# EasyEDA Pro project STM32平衡小车V1.2.eprj

# Schematic 平衡小车

## Sheets
1 STM32F103C8T6: Create Date: 2023-11-09; Page Name: STM32F103C8T6; Project Name: STM32平衡小车V1.2; Schematic Name: 平衡小车; Update Date: 2023-12-28; Company: 嘉立创EDA; Page Size: A4; Version: V1.0
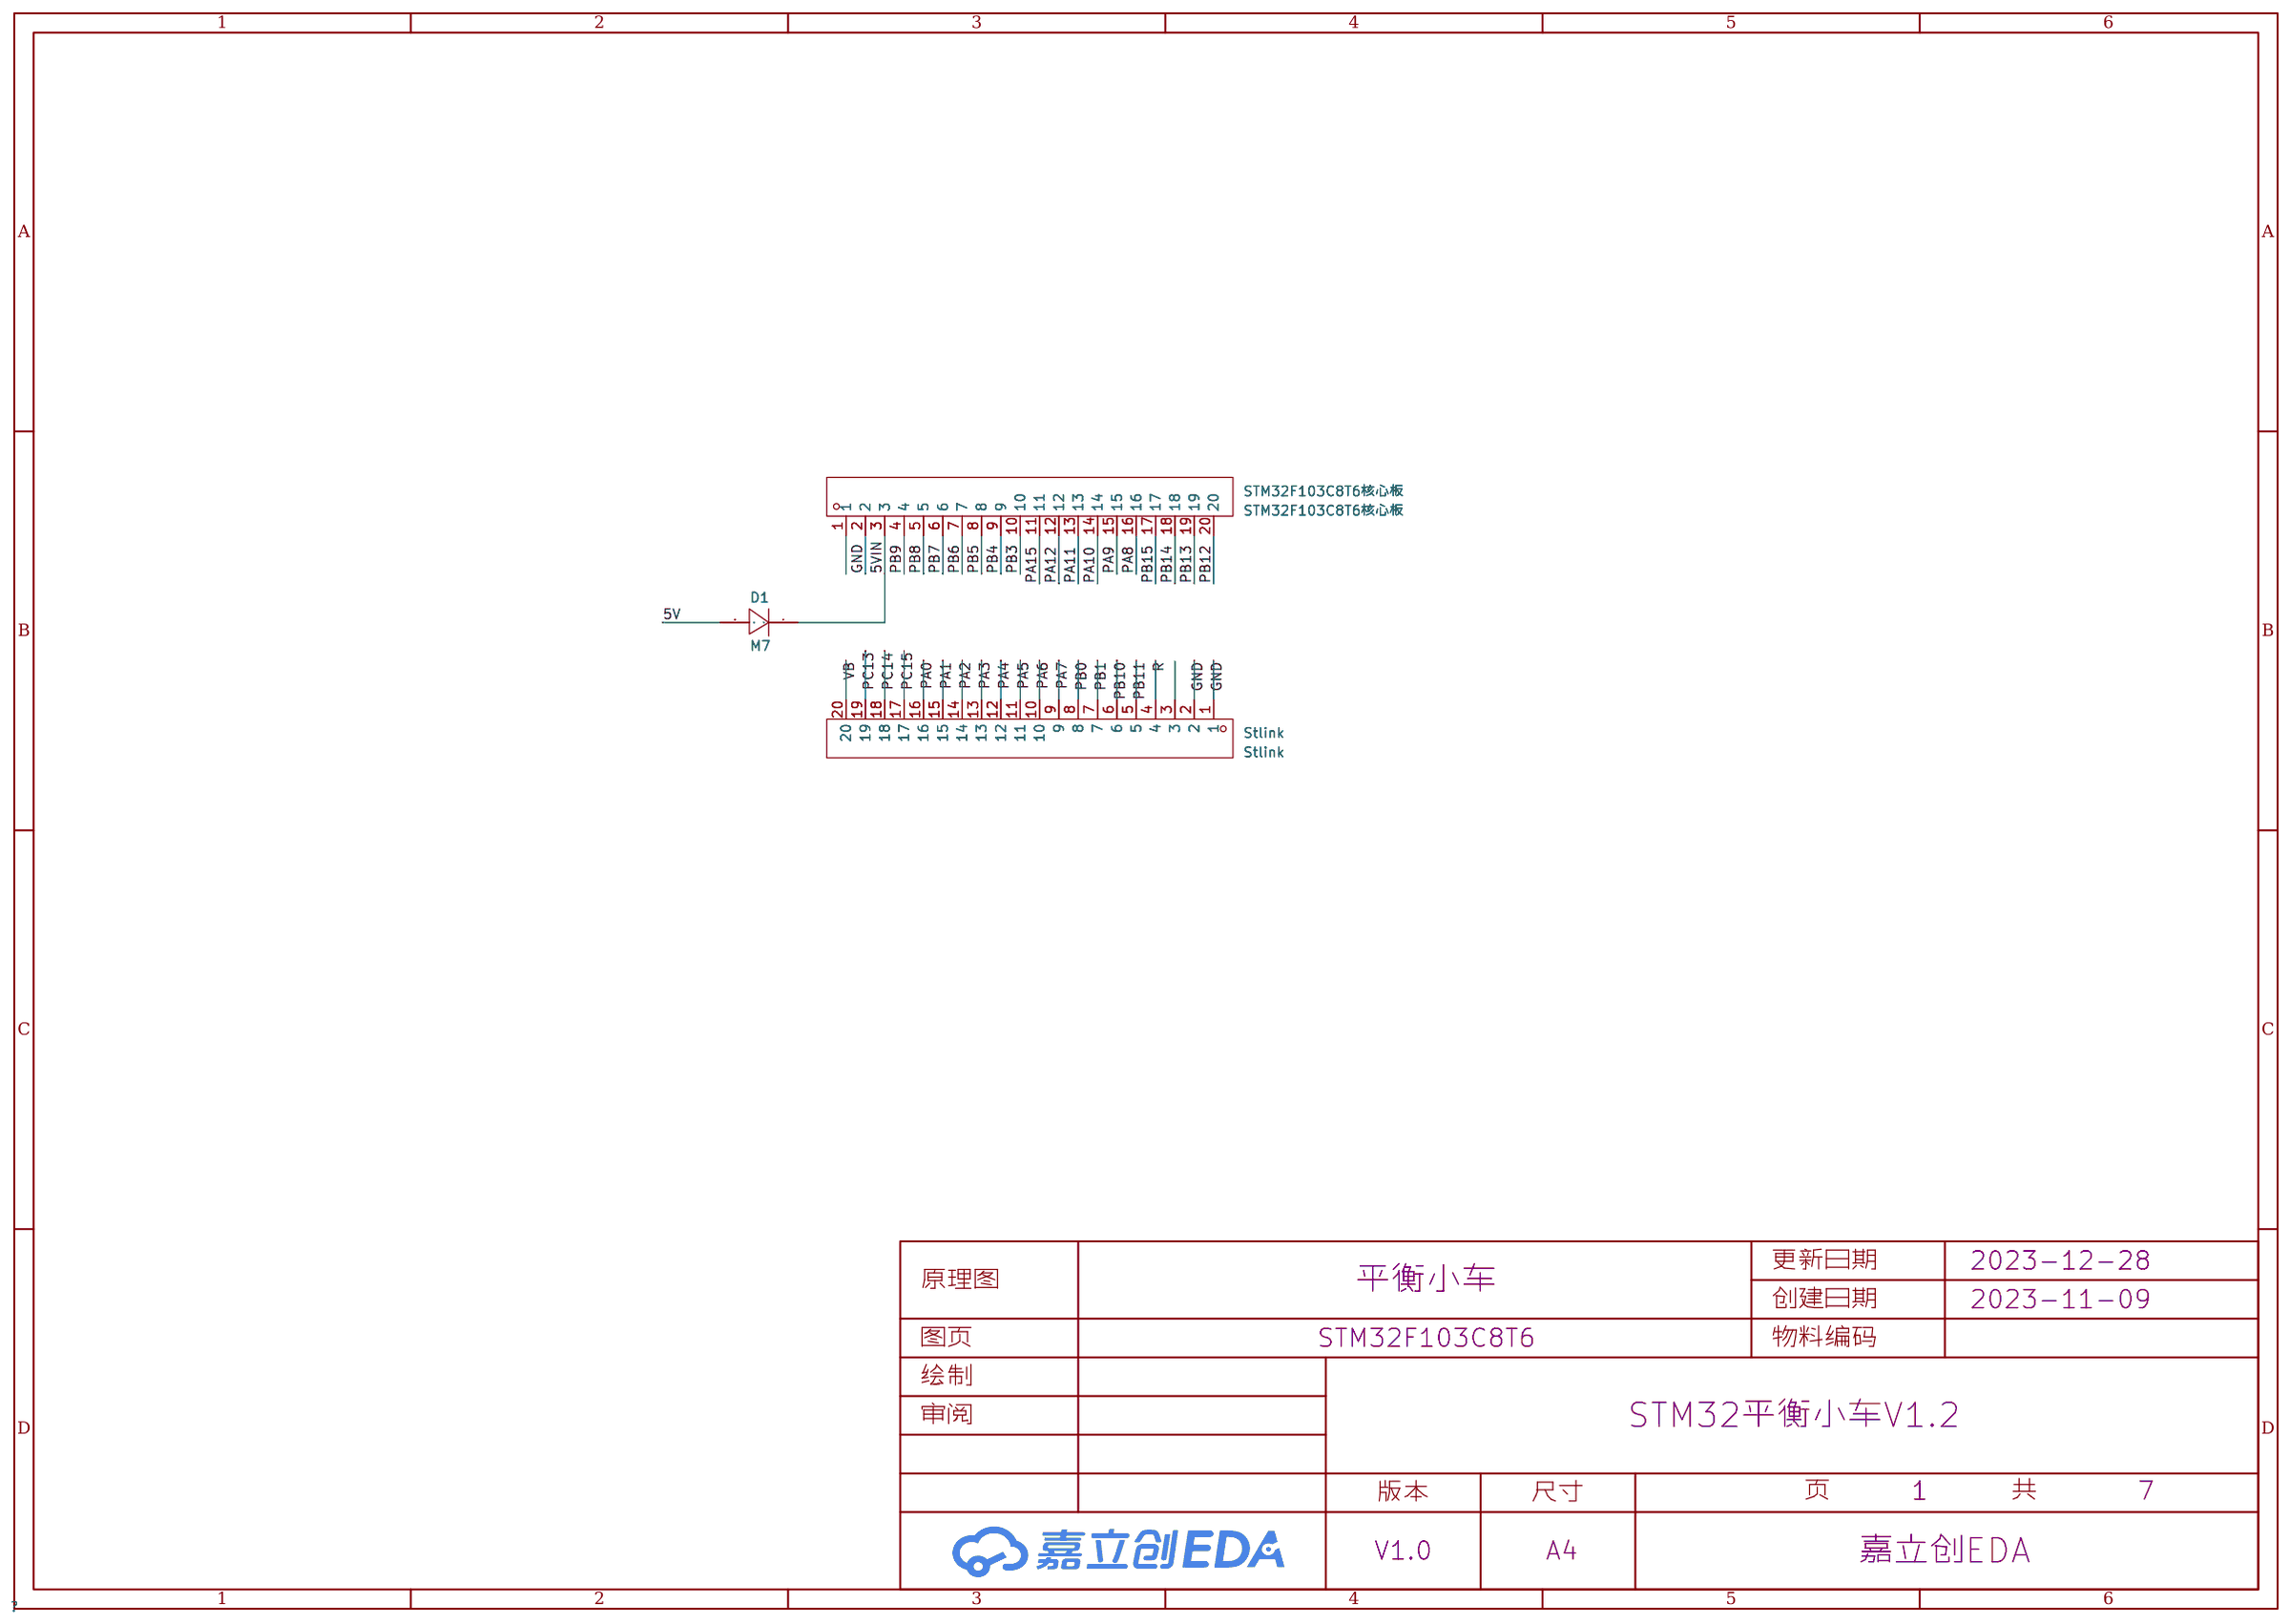
[diagram p0: STM32F103C8T6]
2 蓝牙: Page Name: 蓝牙; Update Date: 2023-12-26
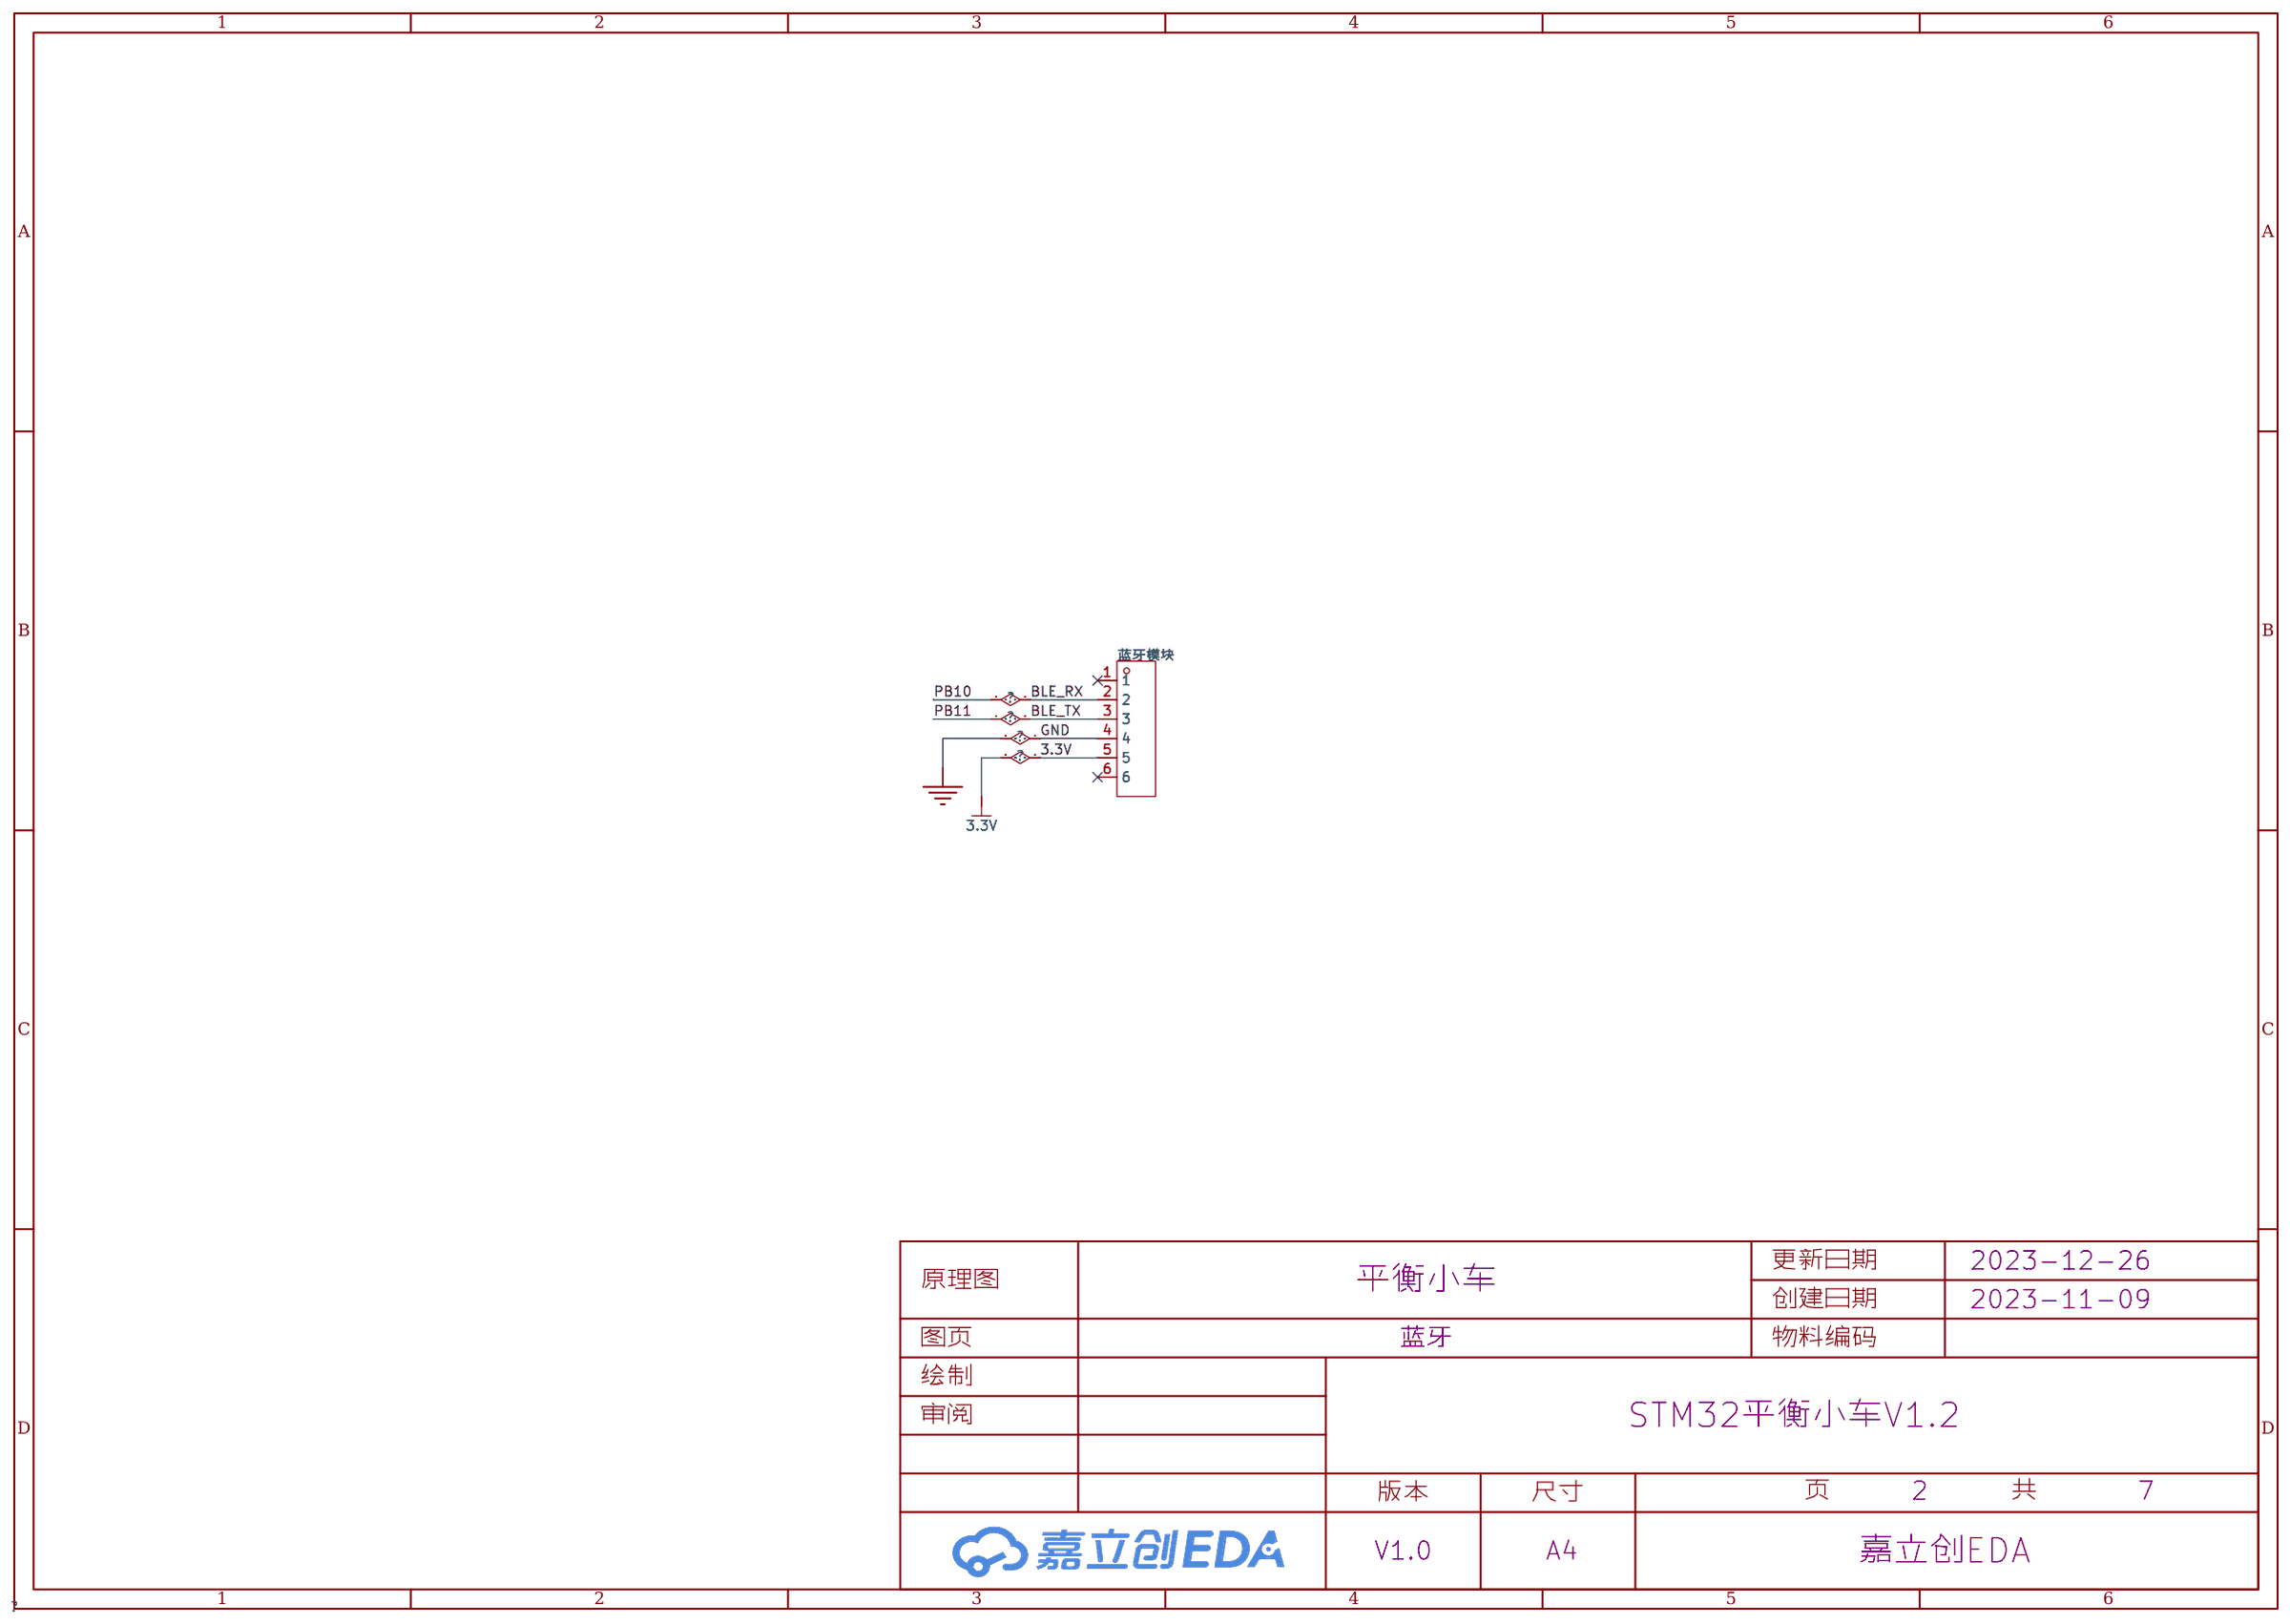
[diagram p1: 蓝牙]
3 陀螺仪: Page Name: 陀螺仪; Update Date: 2024-01-15
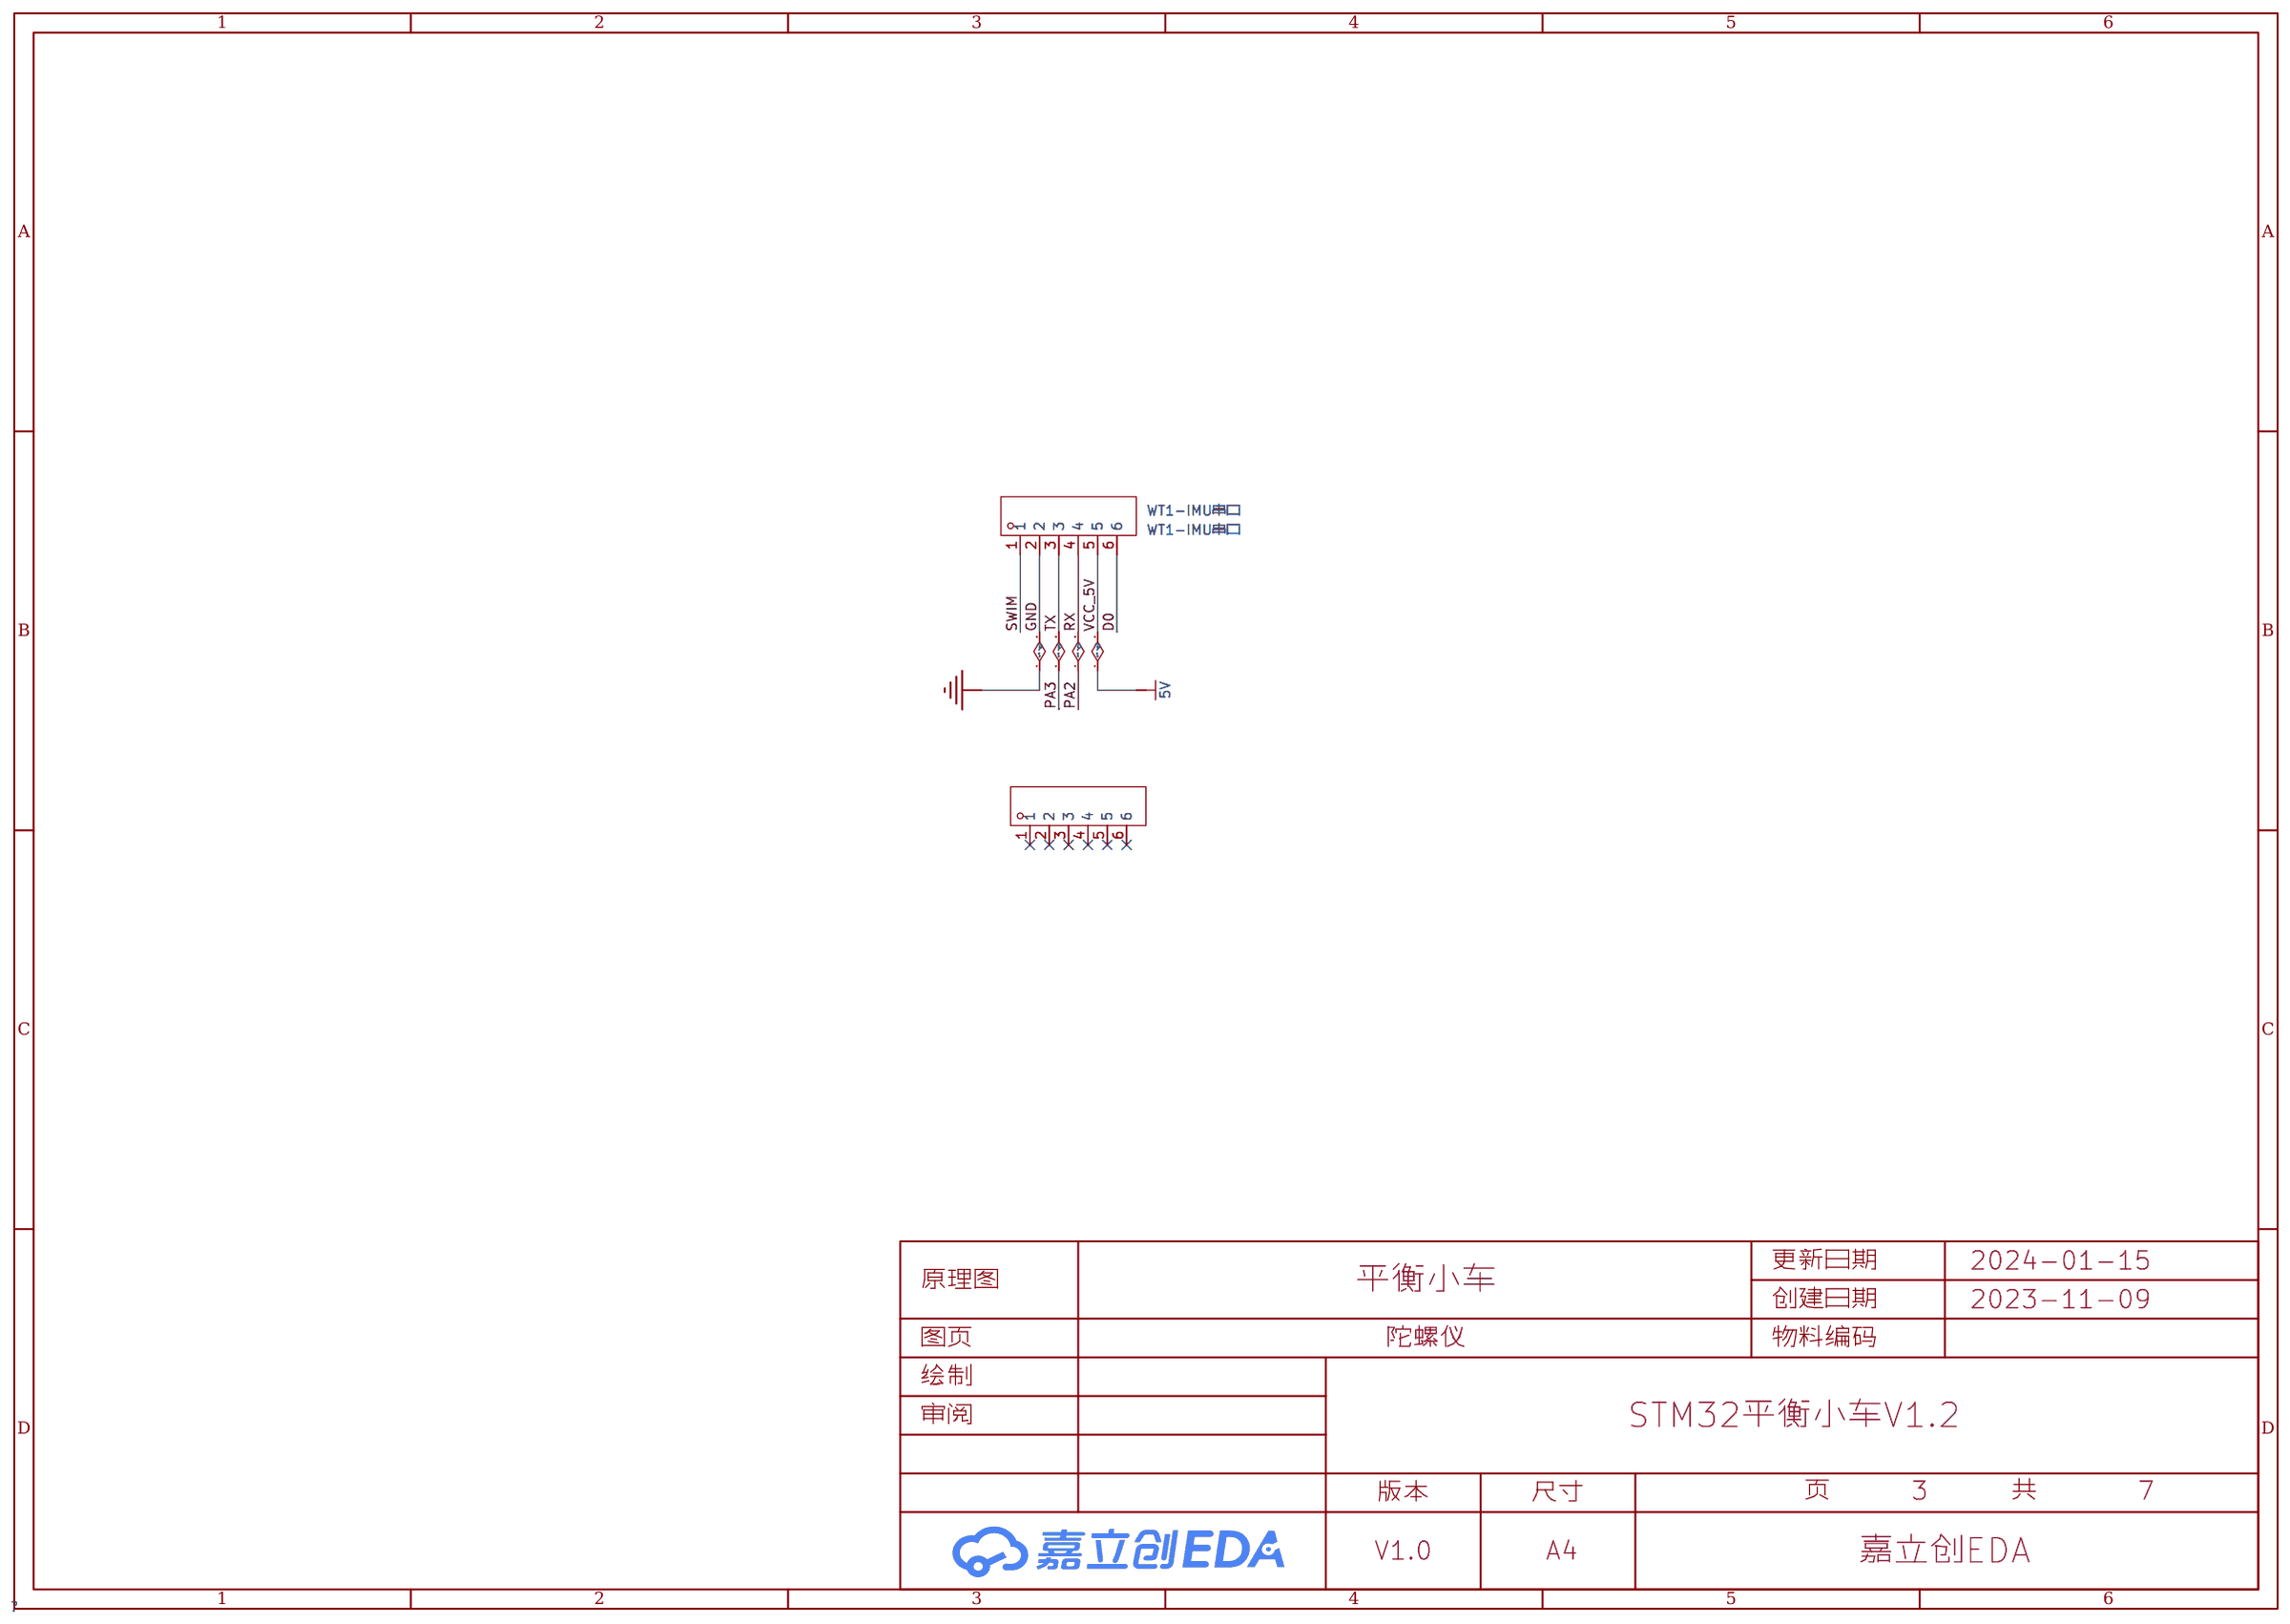
[diagram p2: 陀螺仪]
4 电源与降压模块: Page Name: 电源与降压模块; Update Date: 2023-12-26
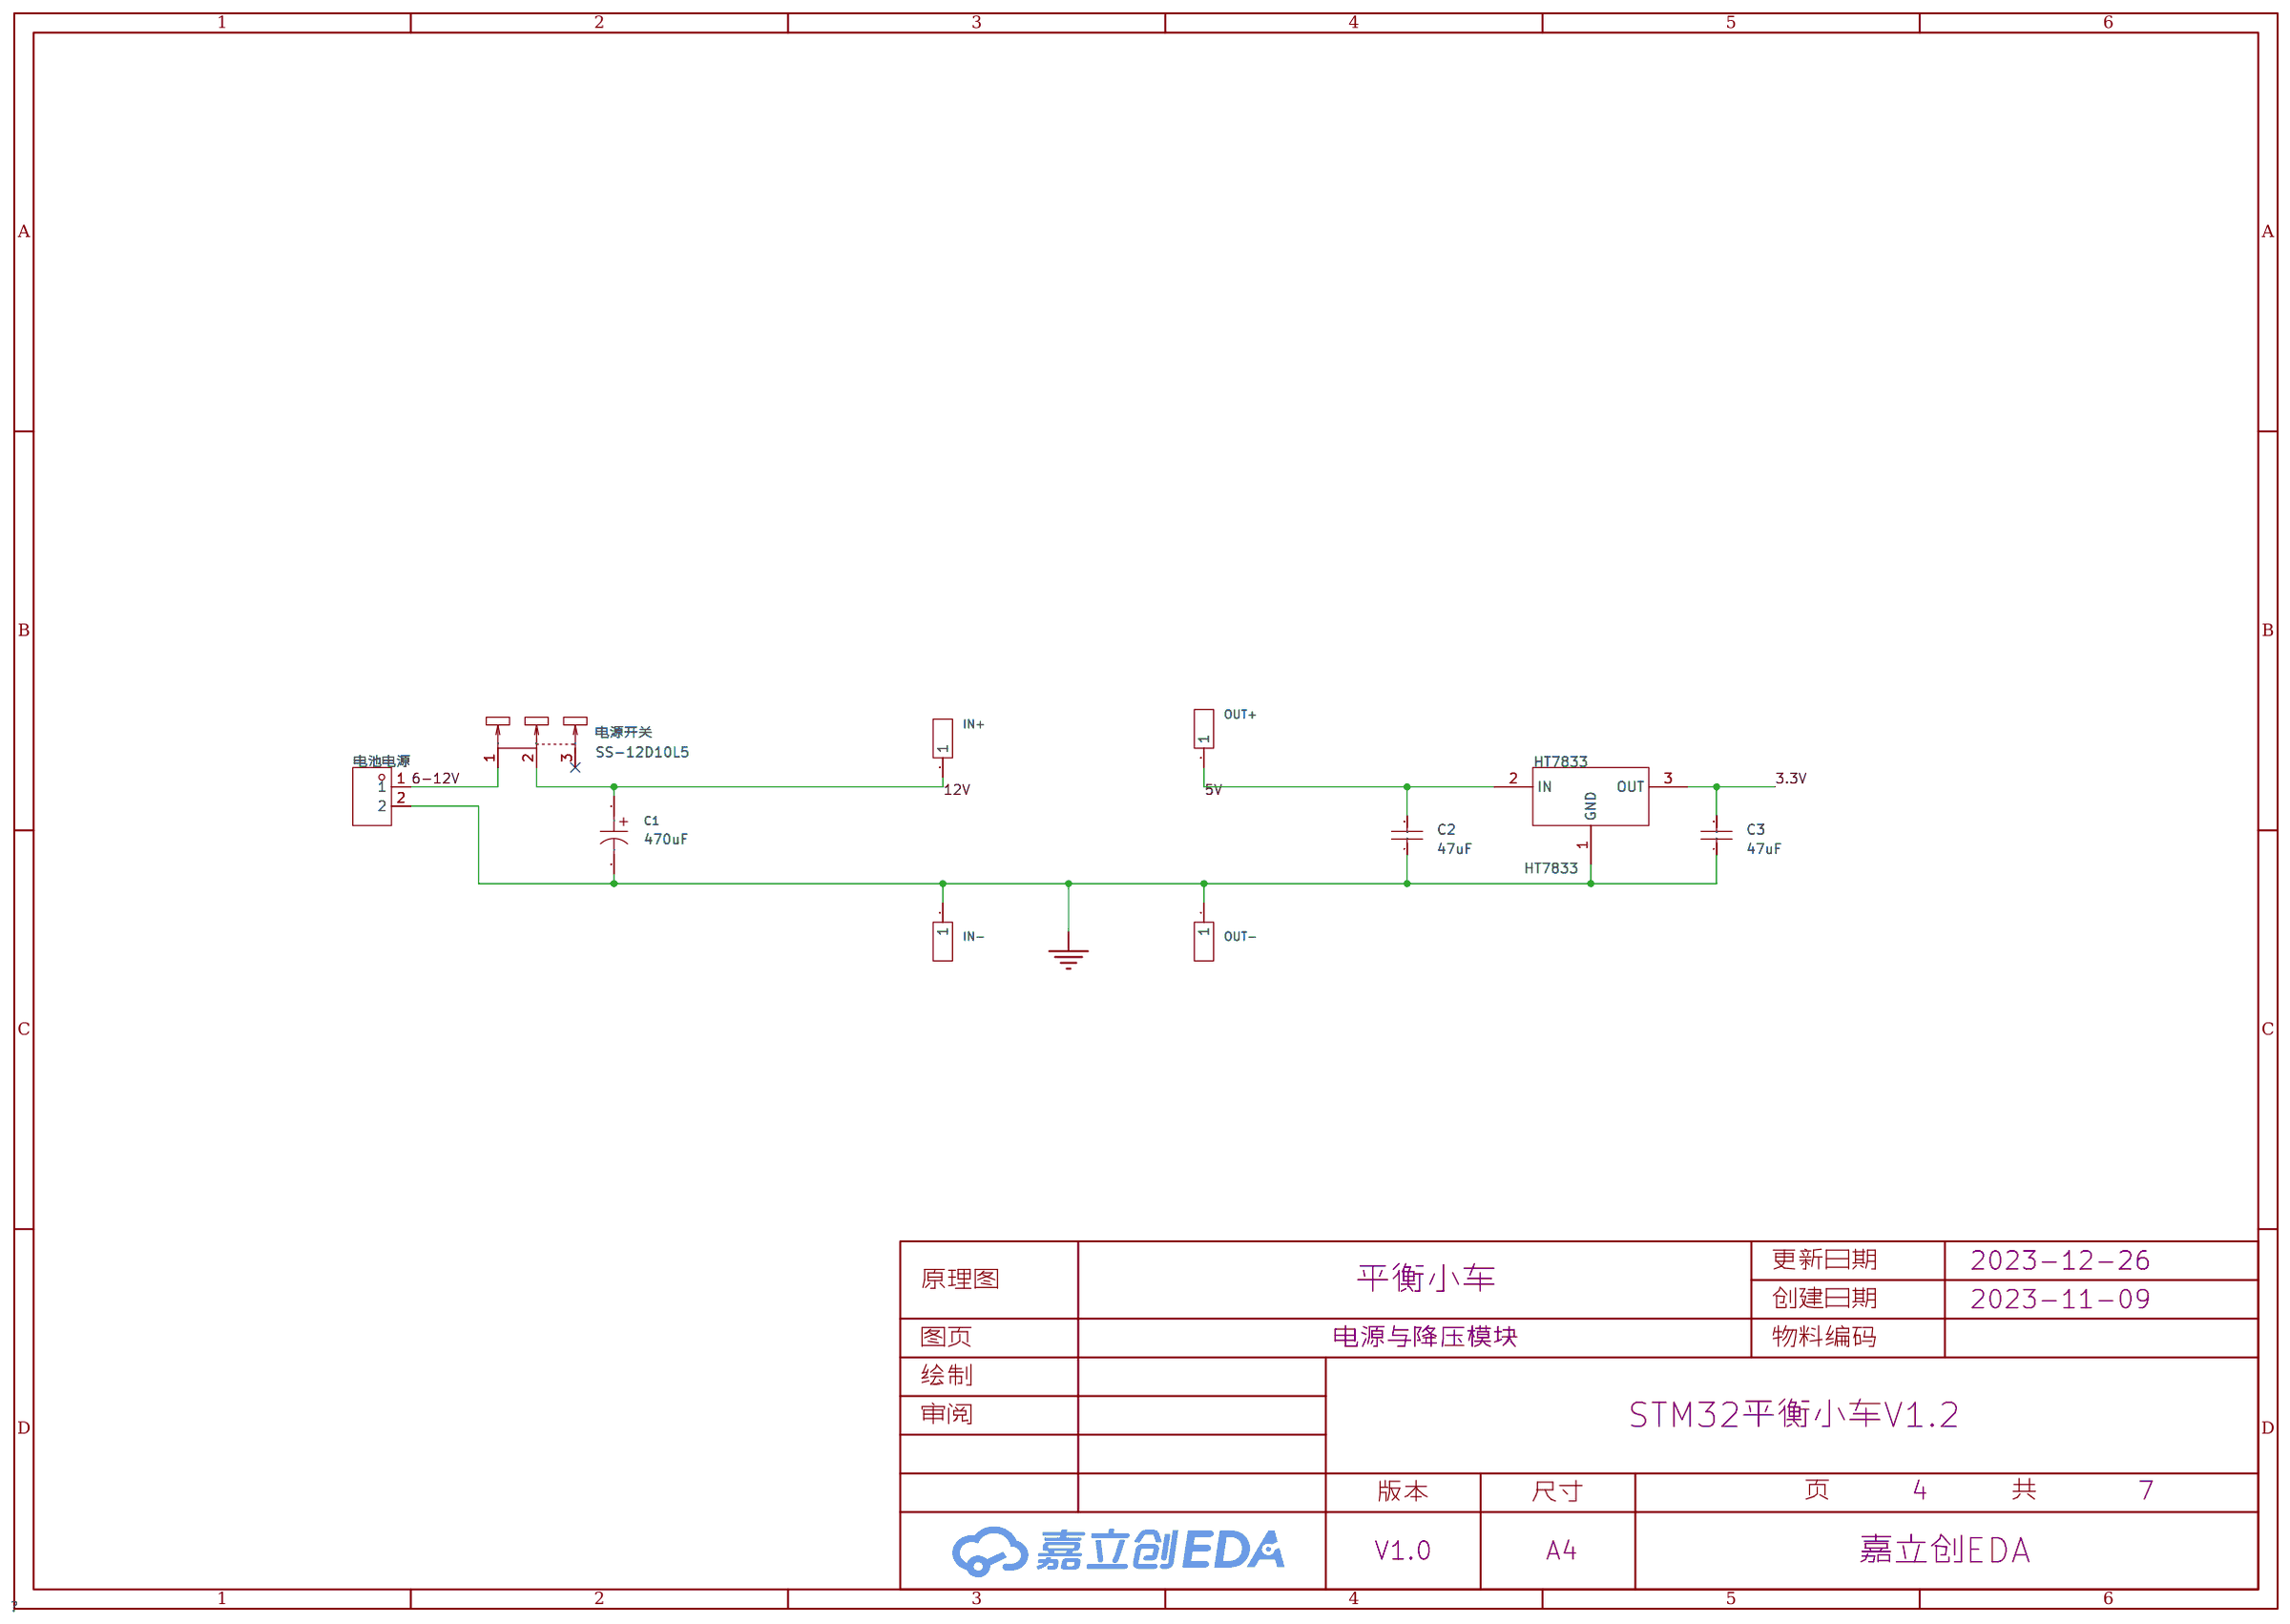
[diagram p3: 电源与降压模块]
5 电机接口: Page Name: 电机接口.平衡小车; Update Date: 2024-01-15
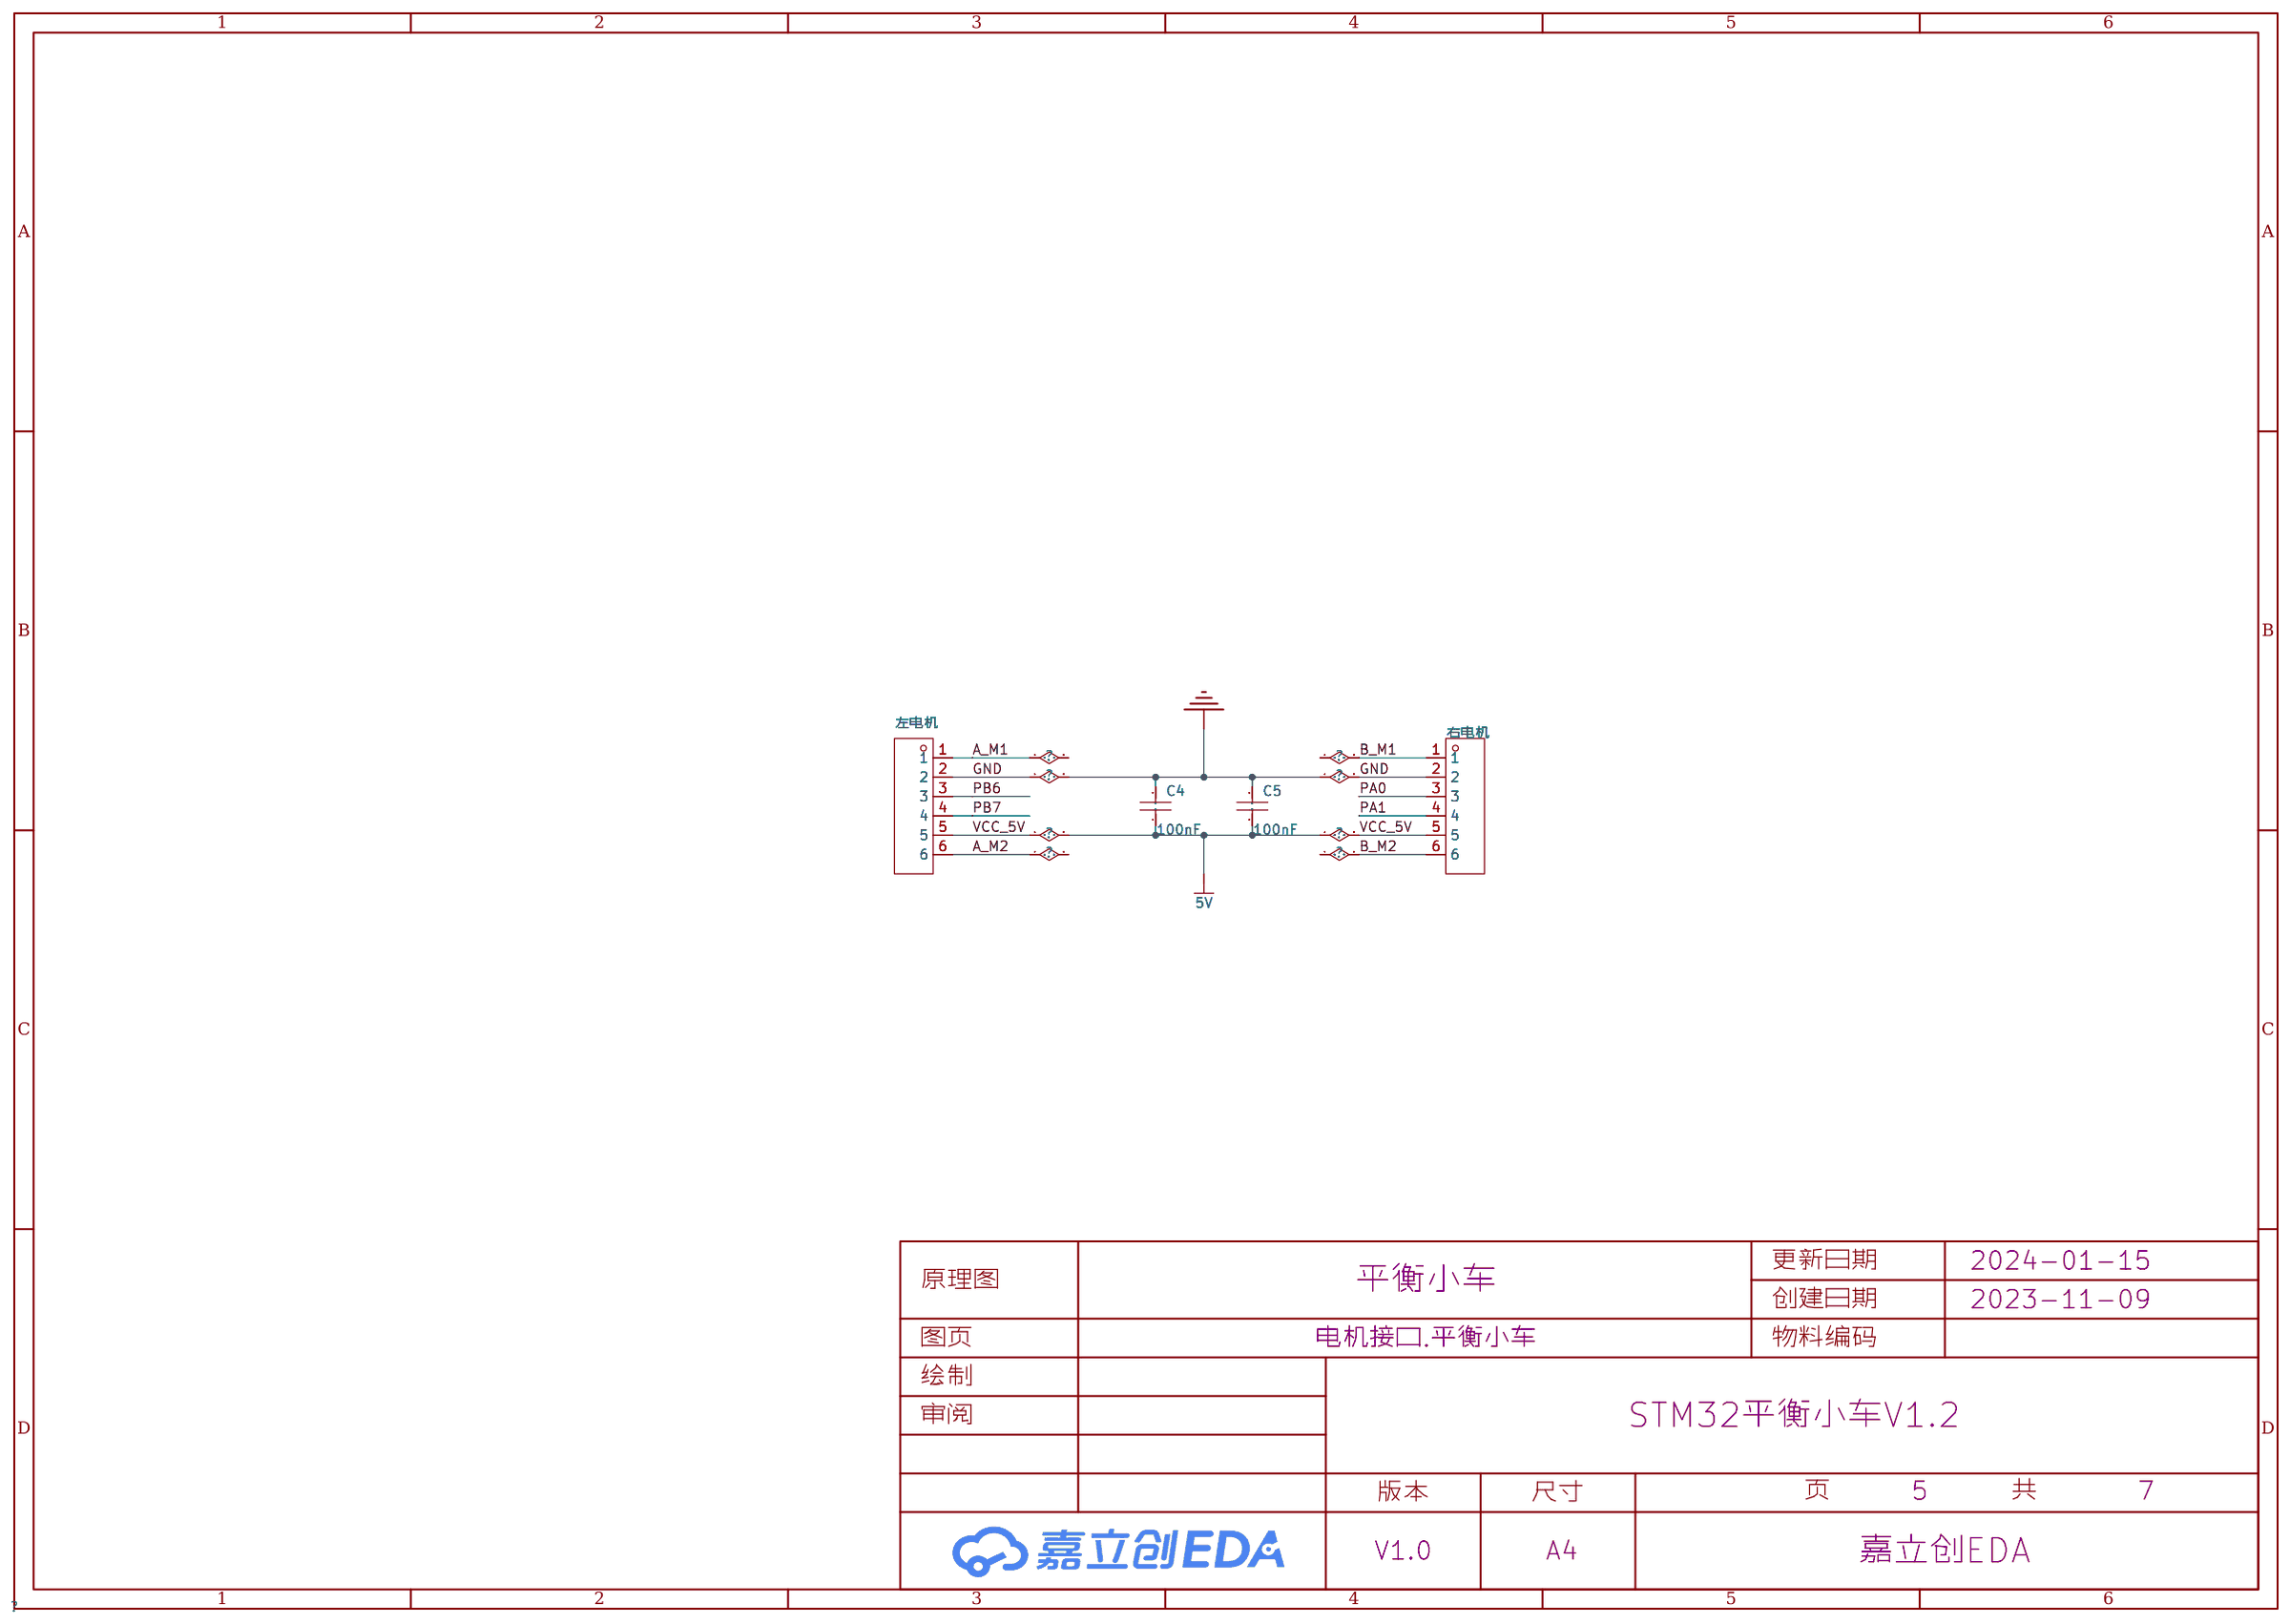
[diagram p4: 电机接口]
6 OLED: Page Name: OLED; Update Date: 2024-01-15
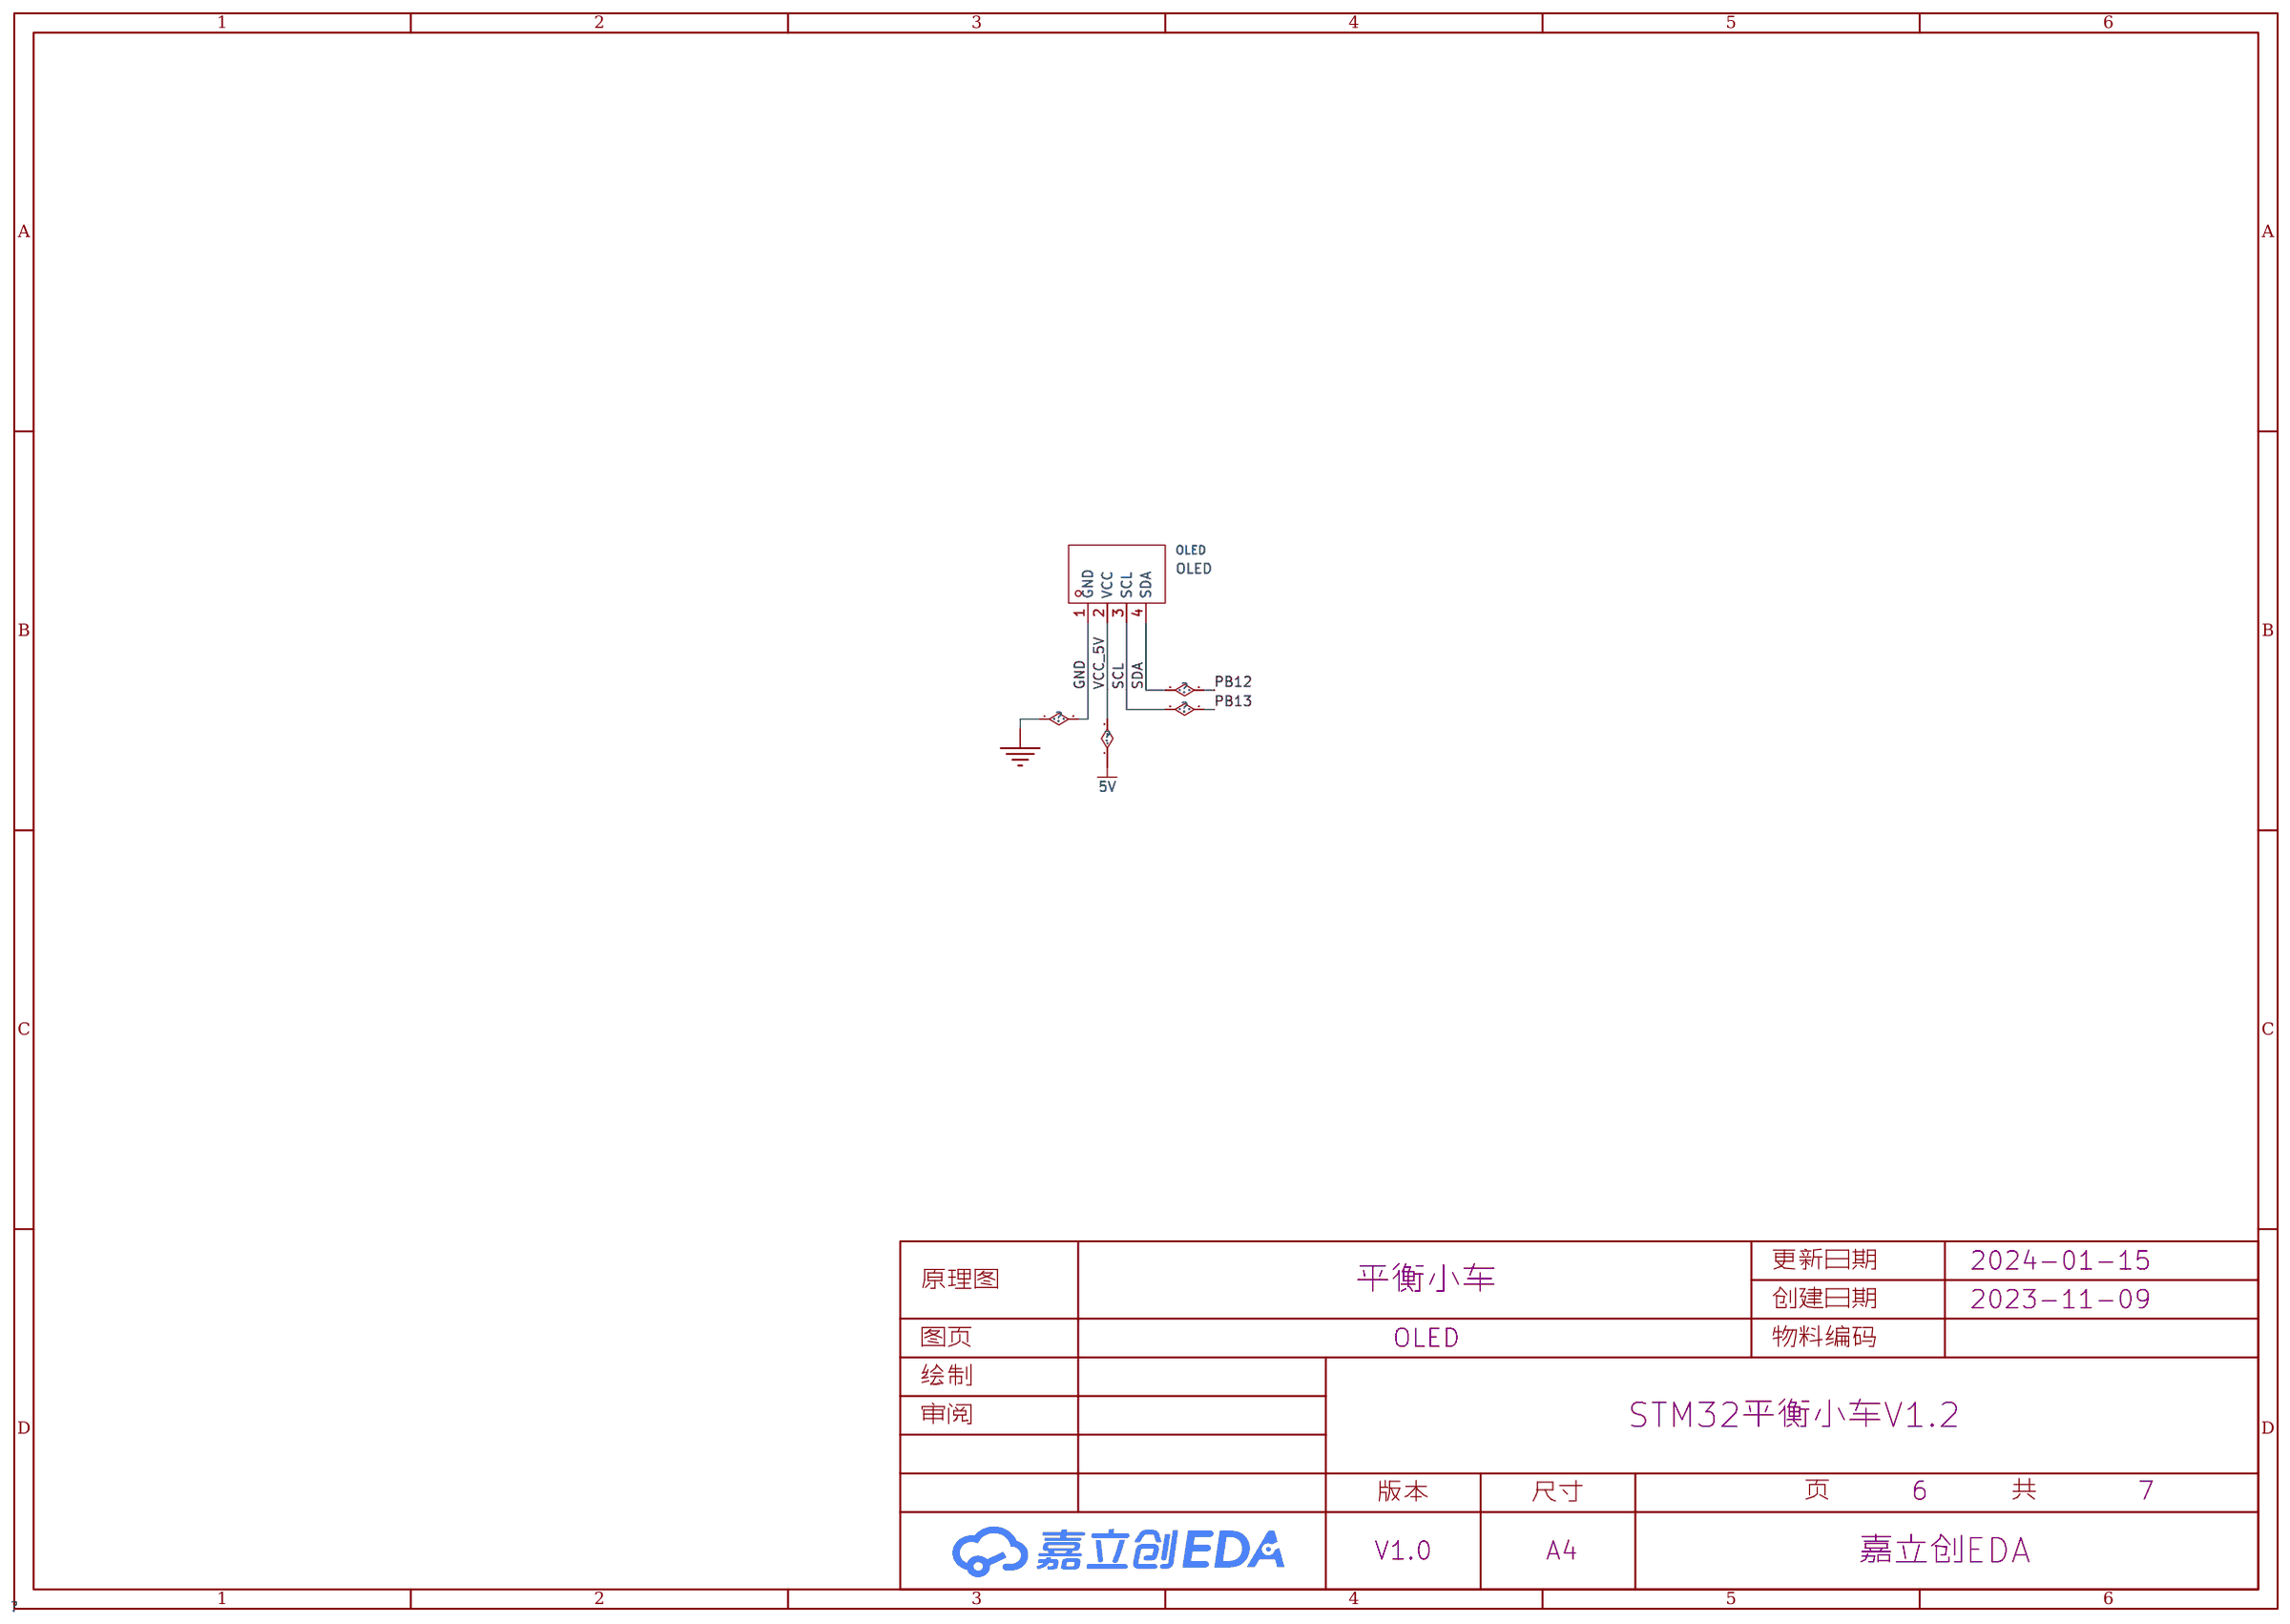
[diagram p5: OLED]
7 TB6612FNG(电机驱动板): Create Date: 2024-01-15; Page Name: TB6612FNG(电机驱动板); Update Date: 2024-01-15
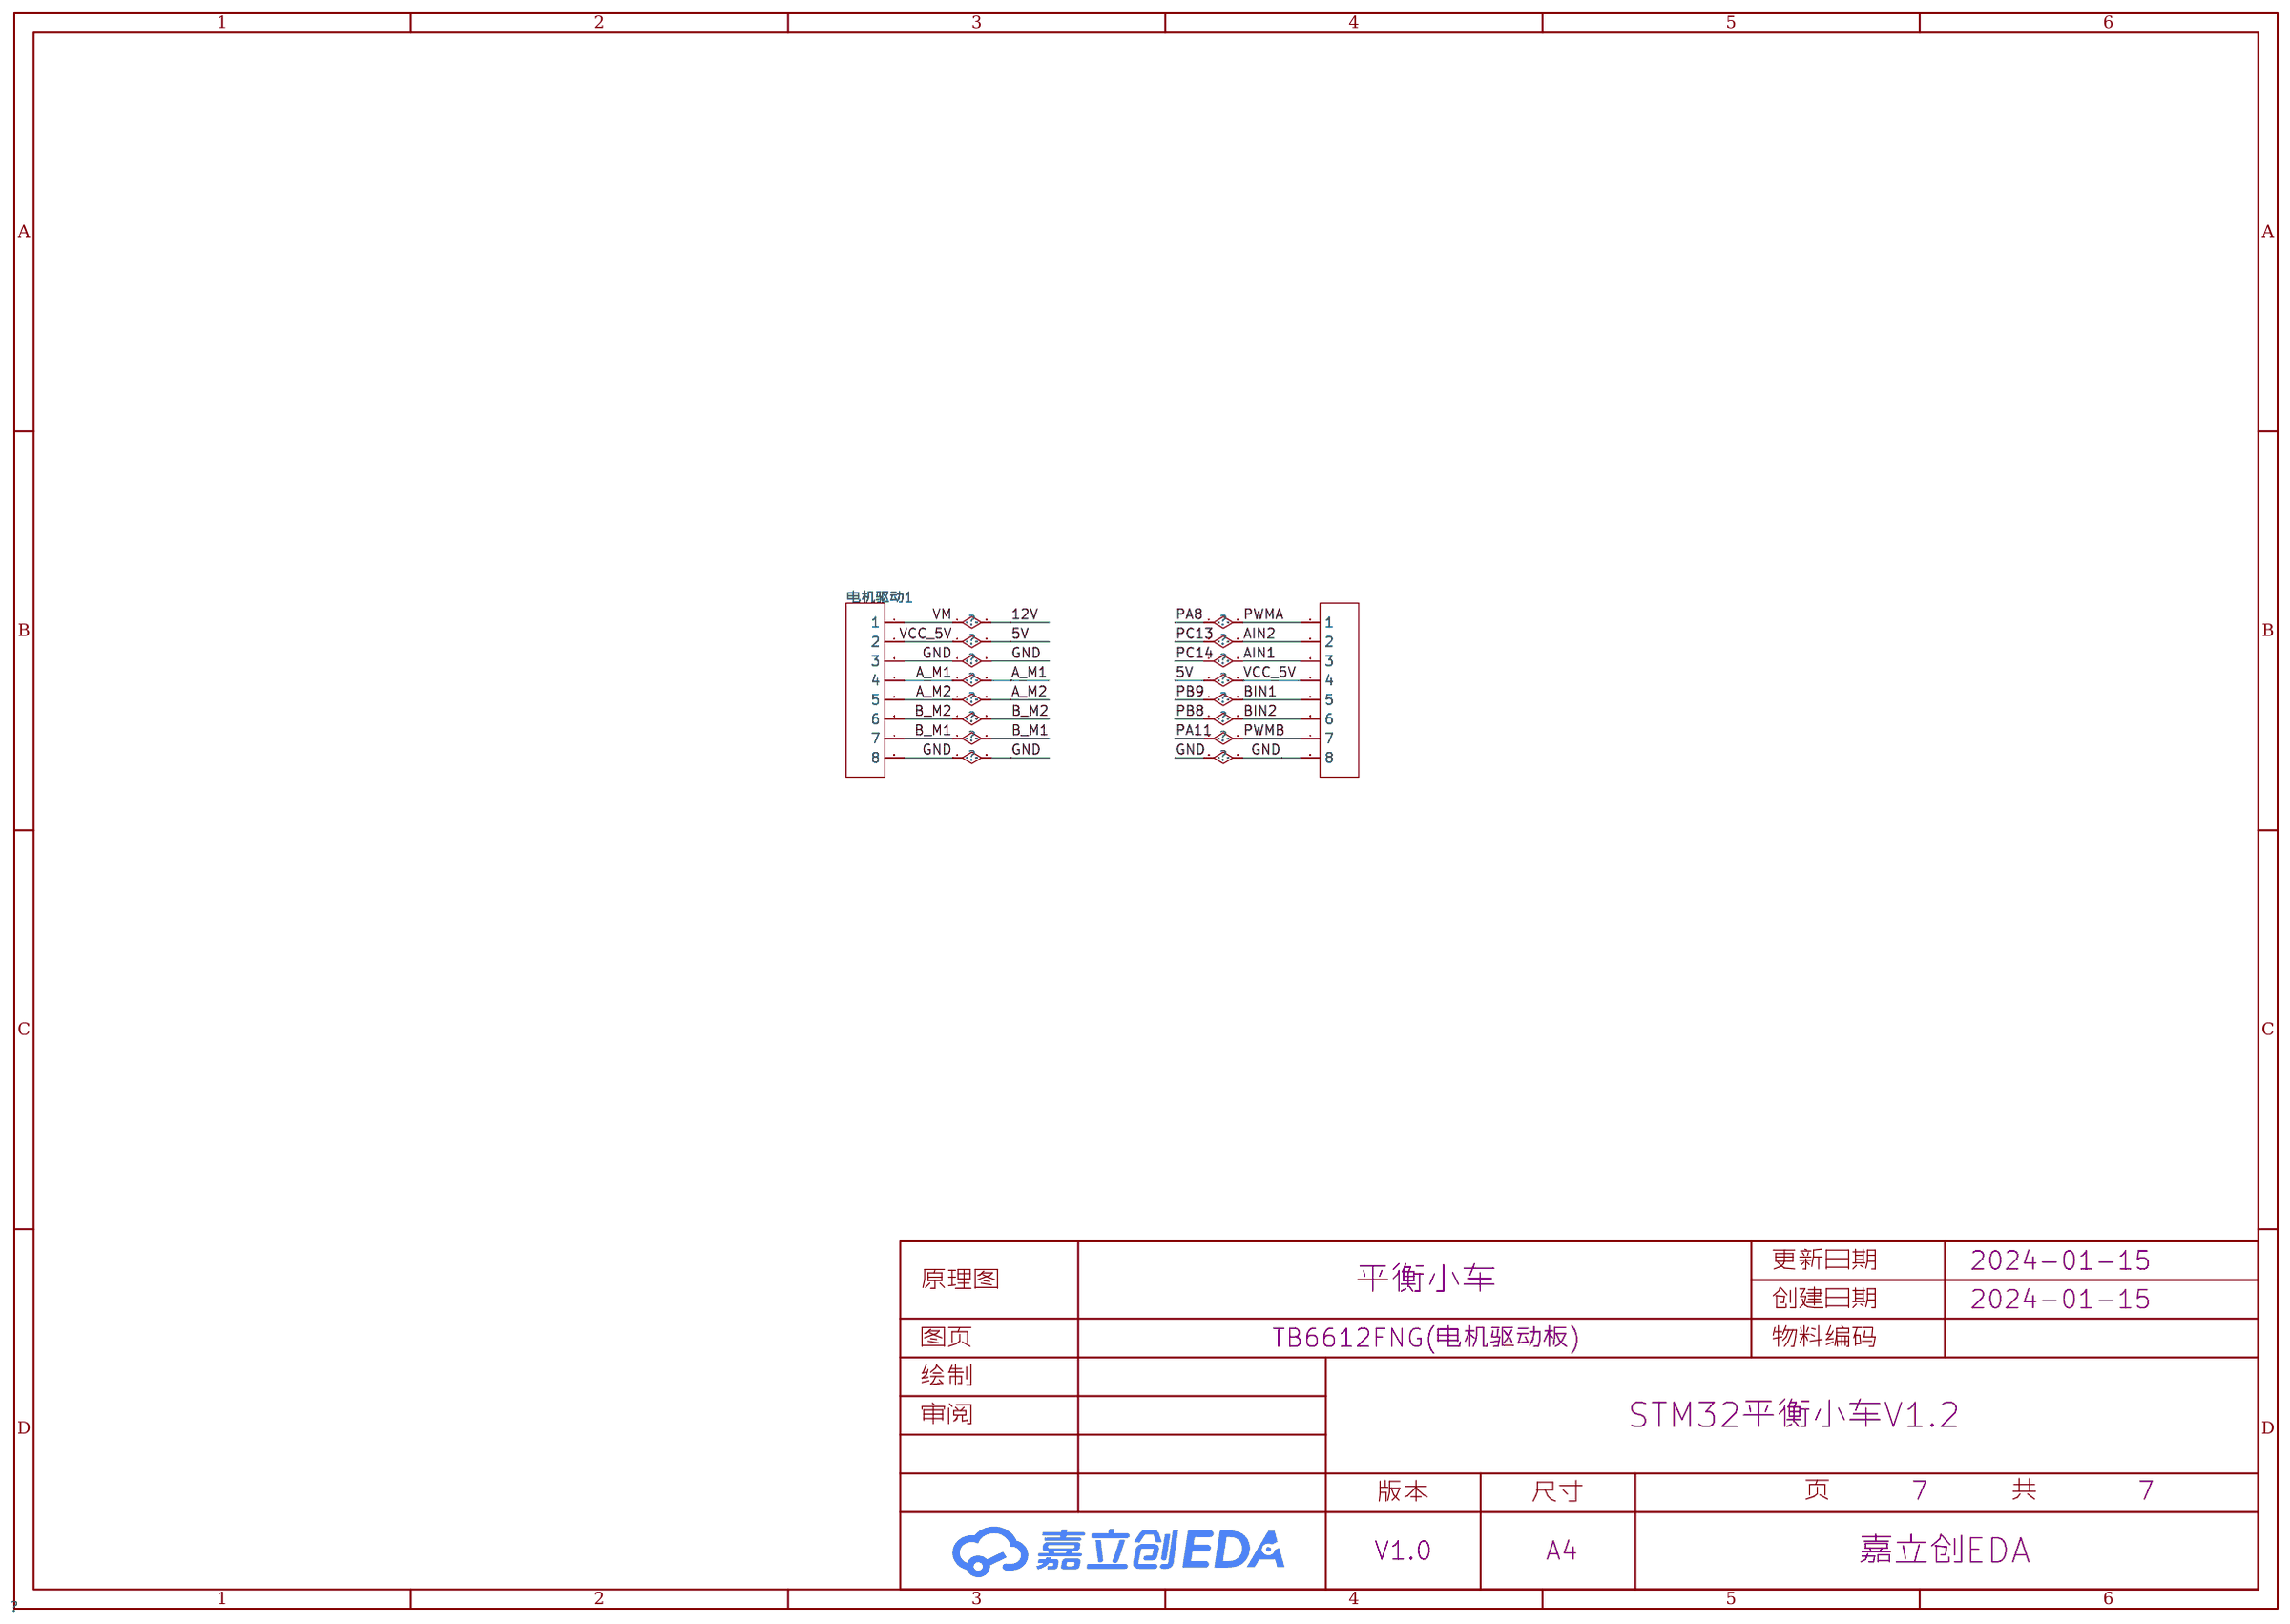
[diagram p6: TB6612FNG(电机驱动板)]

## Parts
sheet OLED
OLED  OLED  [OLED-TH_L27.8-W27.2-P2.54_C9900033791]
sheet STM32F103C8T6
D1  M7  [SMA_L4.3-W2.6-LS5.2-RD]
Stlink  Stlink  [HDR-TH_20P-P2.54-V-F]
STM32F103C8T6核心板  STM32F103C8T6核心板  [HDR-TH_20P-P2.54-V-F]
sheet TB6612FNG(电机驱动板)
U3  2.54-1*8P母环保  [HDR-TH_8P-P2.54-V-F-1]
电机驱动1  2.54-1*8P母环保  [HDR-TH_8P-P2.54-V-F-1]
sheet 电机接口
C4  100nF  [C0603]
C5  100nF  [C0603]
右电机  HDGC2001WR-6P  [CONN-TH_6P-P2.00_HDGC_HDGC2001WR-6P]
左电机  HDGC2001WR-6P  [CONN-TH_6P-P2.00_HDGC_HDGC2001WR-6P]
sheet 电源与降压模块
C1  470uF  [CAP-SMD_BD6.3-L6.6-W6.6-LS7.6-RD]
C2  47uF  [C0603]
C3  47uF  [C0603]
HT7833  HT7833  [SOT-89_L4.5-W2.5-P1.50-LS4.2-BR]
IN+  2.54-1*1P针  [HDR-TH_1P-P2.54-V-M]
IN-  2.54-1*1P针  [HDR-TH_1P-P2.54-V-M]
OUT+  2.54-1*1P针  [HDR-TH_1P-P2.54-V-M]
OUT-  2.54-1*1P针  [HDR-TH_1P-P2.54-V-M]
电池电源  ZX-XH2.54-2PZZ  [CONN-TH_2P-P2.50_HX25003-2A]
电源开关  SS-12D10L5  [SW-TH_SS-12D10L5]
sheet 蓝牙
蓝牙模块  2.54-1*6P母  [HDR-TH_6P-P2.54-V-F]
sheet 陀螺仪
U1  2.54-1*6P母  [HDR-TH_6P-P2.54-V-F]
WT1-IMU串口  WT1-IMU串口  [HDR-TH_6P-P2.54-V-F]

## Library data of the parts
OLED = HS96L03W2C03: 尺寸(inch)：0.96寸 0.96&apos; 像素分辨率：128x64 128*64主控芯片：SSD1315 接口类型：I2C 外形:27.3*27.8；IIC/3SPI/4SPI串口通讯,工作温度范围-40℃—+70℃。4PIN黑底白光。; LCSC Part Name: 0.96寸OLED显示屏窄白光IIC; Supplier Part: C5248080; Manufacturer: HS(汉昇); JLCPCB Part Class: Extended Part; Datasheet: https://atta.szlcsc.com/upload/public/pdf/source/20230627/763D01F79A90007632F098068C7C8AD9.pdf; Supplier: LCSC
D1 = M7_C95872: 二极管配置:-;正向压降(Vf):1.1V@1A;直流反向耐压(Vr):1kV;平均整流电流(Io):1A;; LCSC Part Name: 电压:1kV 电流:1A; Supplier Part: C95872; Manufacturer: MDD; Supplier Footprint: SMA(DO-214AC); JLCPCB Part Class: 基础库; Datasheet: https://atta.szlcsc.com/upload/public/pdf/source/20230314/2A19294A7E86AE073FE0E8B47BC771B8.pdf; Supplier: LCSC; Forward Voltage (Vf@If): 1.1V@1A; Reverse Voltage (Vr): 1kV; Average Rectified Current (Io): 1A; Reverse Leakage Current: 5uA@1kV
Stlink STM32F103C8T6核心板 = 22850120ANG1SYA01: 排数:单排;总孔位数:20P;间距:2.54mm;插孔结构:1x20P;行距:-;安装类型:直插;塑高:-;触头材质:黄铜;触头镀层:-;; LCSC Part Name: 间距:2.54mm 1x20P 直插; Supplier Part: C429947; Manufacturer: JILN(锦凌); Supplier Footprint: 插件,P=2.54mm; JLCPCB Part Class: 扩展库; Datasheet: https://atta.szlcsc.com/upload/public/pdf/source/20190920/C429966_F6288D72CB1EF194DAF75E8AC5D57877.pdf; Supplier: LCSC; Number of Rows: 单排; Number of Holes: 20P; Pitch: 2.54mm; Holes Structure: 1x20P; Mounting Type: 直插; Contact Material: 黄铜
U3 电机驱动1 = 2.54-1*8P母环保: 排数:单排;总孔位数:8P;间距:2.54mm;插孔结构:1x8P;行距:-;安装类型:直插;塑高:-;触头材质:-;触头镀层:-;; LCSC Part Name: 间距:2.54mm 1x8P 直插; Supplier Part: C27438; Manufacturer: BOOMELE(博穆精密); Supplier Footprint: 插件,P=2.54mm; JLCPCB Part Class: Extended Part; Datasheet: https://atta.szlcsc.com/upload/public/pdf/source/20210301/C2718488_F4427B881E42CAA8DDB0B1C12B3A522C.pdf; Supplier: LCSC; Number of Rows: 单排; Number of Holes: 8P; Pitch: 2.54mm; Holes Structure: 1x8P; Mounting Type: 直插
C2-C5 = CC0603KRX7R9BB104: 容值:100nF;精度:±10%;额定电压:50V;材质(温度系数):X7R;; LCSC Part Name: 100nF ±10% 50V; Supplier Part: C14663; Manufacturer: YAGEO(国巨); Supplier Footprint: 0603; JLCPCB Part Class: 基础库; Datasheet: https://atta.szlcsc.com/upload/public/pdf/source/20180910/C282072_33301C7F631E79921B82A8DAC6BCC5B3.pdf; Supplier: LCSC; Tolerance: ±10%; Voltage Rated: 50V; Temperature Coefficient: X7R
右电机 左电机 = HDGC2001WR-6P: LCSC Part Name: PH2.0弯针 6P; Supplier Part: C5175243; Manufacturer: HDGC(华德共创); Supplier Footprint: 弯插,P=2mm; JLCPCB Part Class: 扩展库; Datasheet: https://atta.szlcsc.com/upload/public/pdf/source/20220916/36534CA64A2134C65DEF28B604EC5CCB.pdf; Supplier: LCSC
C1 = RVT1C471M0607: 容值:470uF;精度:±20%;额定电压:16V;电容体直径:6.3mm;电容体长度:7.7mm;工作寿命:2000hrs@105℃;工作温度:-55℃~+105℃;; LCSC Part Name: 470uF ±20% 16V; Supplier Part: C2977552; Manufacturer: ROQANG(容强); Supplier Footprint: SMD,6.3x7.7mm; JLCPCB Part Class: 扩展库; Supplier: LCSC; Tolerance: ±20%; Rated Voltage: 16V; φD: 6.3mm; L: 7.7mm; Lifetime @ Temp: 2000hrs@105℃; Operating Temperature: -55℃~+105℃
HT7833 = HT7833_C50936: 输出类型:固定;输出极性:正;最大输入电压:8V;输出电压:3.3V;输出电流:500mA;电源纹波抑制比(PSRR):-;; Supplier Part: C50936; Manufacturer: HOLTEK(合泰/盛群); Supplier Footprint: SOT-89-3; JLCPCB Part Class: 扩展库; Datasheet: https://atta.szlcsc.com/upload/public/pdf/source/20150618/1457707321825.pdf; Supplier: LCSC; Output Type: 固定; Output Polarity: 正; Number of Outputs: 1; Maximum Input Voltage: 8V; Output Voltage: 3.3V; Dropout Voltage: 500mV@(500mA); Output Current: 500mA
IN+ IN- OUT+ OUT- = 2.54-1*1P针: 排数:单排;总PIN位数:1P;间距:-;插针结构:-;行距:-;安装类型:直插;圆针/方针:-;额定电流:-;额定电压:-;配合针长度:-;塑高:-;触头材质:-;触头镀层:-;颜色:黑色;; LCSC Part Name: 直插; Supplier Part: C81276; Manufacturer: BOOMELE(博穆精密); Supplier Footprint: 插件,P=2.54mm; JLCPCB Part Class: 扩展库; Datasheet: https://atta.szlcsc.com/upload/public/pdf/source/20221018/3E9408392E35E6F57A28985E5F7BF5C9.pdf; Supplier: LCSC; Number of Rows: 单排; Number of Pins: 1P; Mounting Type: 直插; Color: 黑色
电池电源 = ZX-XH2.54-2PZZ: 插针结构:1x2P;间距:2.54mm;公母:公;安装方式:直插;行距:-;排数:1;每排PIN数:2;参考系列:XH;额定电流:3A;触头材质:黄铜;触头镀层:锡;工作温度范围:-25℃~+85℃;焊接温度(最大值):260℃;; LCSC Part Name: 1x2P 间距:2.54mm 直插 系列:XH; Supplier Part: C7429632; Manufacturer: Megastar(兆星); Supplier Footprint: 插件,P=2.54mm; JLCPCB Part Class: 扩展库; Datasheet: https://atta.szlcsc.com/upload/public/pdf/source/20230619/19BA6947230AA44A04D3EDD65E618FD0.pdf; Supplier: LCSC; Pins Structure: 1x2P; Pitch: 2.54mm; Gender: 公; Mounting Style: 直插; Number of Rows: 1; Number of PINs Per Row: 2; Reference Series: XH; Current Rating (Max): 3A; Contact Material: 黄铜; Contact Plating: 锡; Operating Temperature Range: -25℃~+85℃; Welding Temperature (Max): 260℃
电源开关 = SS-12D10L5: 额定电流(DC):3A;额定电压(DC):125V;额定电流(AC):3A;额定电压(AC):125V;电路结构:单刀双掷;安装方式:直插;机械寿命:1万次;开关颜色:黑色;; LCSC Part Name: 柄长5mm 直插双档 滑动开关 大电流; Supplier Part: C319012; Manufacturer: XKB Connectivity(中国星坤); Supplier Footprint: 插件; JLCPCB Part Class: 扩展库; Datasheet: https://atta.szlcsc.com/upload/public/pdf/source/20211009/D6412F37AABE6F9459A6EE7FA4DAEADB.pdf; Supplier: LCSC; Current Rating (DC): 3A; Voltage Rating (DC): 125V; Current Rating (AC): 3A; Voltage Rating (AC): 125V; Circuit: 单刀双掷; Mounting Style: 直插; Mechanical Life: 1万次; Actuator Color: 黑色; Actuator Style: 矩形柱状; Pin Style: PC引脚; Operating Temperature: -40℃~+85℃; Switch Length: 13mm; Switch Width: 6.8mm; Switch Height: 6.4mm
U1 WT1-IMU串口 蓝牙模块 = 2.54-1*6P母: 排数:单排;总孔位数:6P;间距:2.54mm;插孔结构:1x6P;行距:-;安装类型:直插;塑高:-;触头材质:-;触头镀层:-;; LCSC Part Name: 间距:2.54mm 1x6P 直插; Supplier Part: C40877; Manufacturer: BOOMELE(博穆精密); Supplier Footprint: 插件,P=2.54mm; JLCPCB Part Class: 扩展库; Datasheet: https://atta.szlcsc.com/upload/public/pdf/source/20210301/C2718488_F4427B881E42CAA8DDB0B1C12B3A522C.pdf; Supplier: LCSC; Number of Rows: 单排; Number of Holes: 6P; Pitch: 2.54mm; Holes Structure: 1x6P; Mounting Type: 直插

## Nets
3.3V: C3.2 HT7833.3(OUT) 蓝牙模块.5
5V: C2.2 C4.1 C5.1 D1.2(A) HT7833.2(IN) OLED.2(VCC) OUT+.1 U3.4 WT1-IMU串口.5 右电机.5 左电机.5 电机驱动1.2
5VIN: D1.1(K) STM32F103C8T6核心板.3
12V: C1.1 IN+.1 电机驱动1.1 电源开关.2
GND: C1.2 C2.1 C3.1 C4.2 C5.2 HT7833.1(GND) IN-.1 OLED.1(GND) OUT-.1 Stlink.1 Stlink.2 STM32F103C8T6核心板.2 U3.8 WT1-IMU串口.2 右电机.2 左电机.2 电机驱动1.3 电机驱动1.8 电池电源.2 蓝牙模块.4
6-12V: 电池电源.1 电源开关.1
A_M1: 左电机.1 电机驱动1.4
A_M2: 左电机.6 电机驱动1.5
AIN1: Stlink.18 U3.3
AIN2: Stlink.19 U3.2
B_M1: 右电机.1 电机驱动1.7
B_M2: 右电机.6 电机驱动1.6
BIN1: STM32F103C8T6核心板.4 U3.5
BIN2: STM32F103C8T6核心板.5 U3.6
BLE_RX: Stlink.6 蓝牙模块.2
BLE_TX: Stlink.5 蓝牙模块.3
D0: WT1-IMU串口.6
PA0: Stlink.16 右电机.3
PA1: Stlink.15 右电机.4
PA2: Stlink.14 WT1-IMU串口.4
PA3: Stlink.13 WT1-IMU串口.3
PA4: Stlink.12
PA5: Stlink.11
PA6: Stlink.10
PA7: Stlink.9
PA8: STM32F103C8T6核心板.16 U3.1
PA9: STM32F103C8T6核心板.15
PA10: STM32F103C8T6核心板.14
PA11: STM32F103C8T6核心板.13 U3.7
PA12: STM32F103C8T6核心板.12
PA15: STM32F103C8T6核心板.11
PB0: Stlink.8
PB1: Stlink.7
PB3: STM32F103C8T6核心板.10
PB4: STM32F103C8T6核心板.9
PB5: STM32F103C8T6核心板.8
PB6: STM32F103C8T6核心板.7 左电机.3
PB7: STM32F103C8T6核心板.6 左电机.4
PB12: OLED.4(SDA) STM32F103C8T6核心板.20
PB13: OLED.3(SCL) STM32F103C8T6核心板.19
PB14: STM32F103C8T6核心板.18
PB15: STM32F103C8T6核心板.17
PC15: Stlink.17
R: Stlink.4
SWIM: WT1-IMU串口.1
VB: Stlink.20

Not connected (* = marked no-connect by the designer): Stlink 3; STM32F103C8T6核心板 1; U1 1* 2* 3* 4* 5* 6*; 电源开关 3*; 蓝牙模块 1* 6*

# Board PCB1
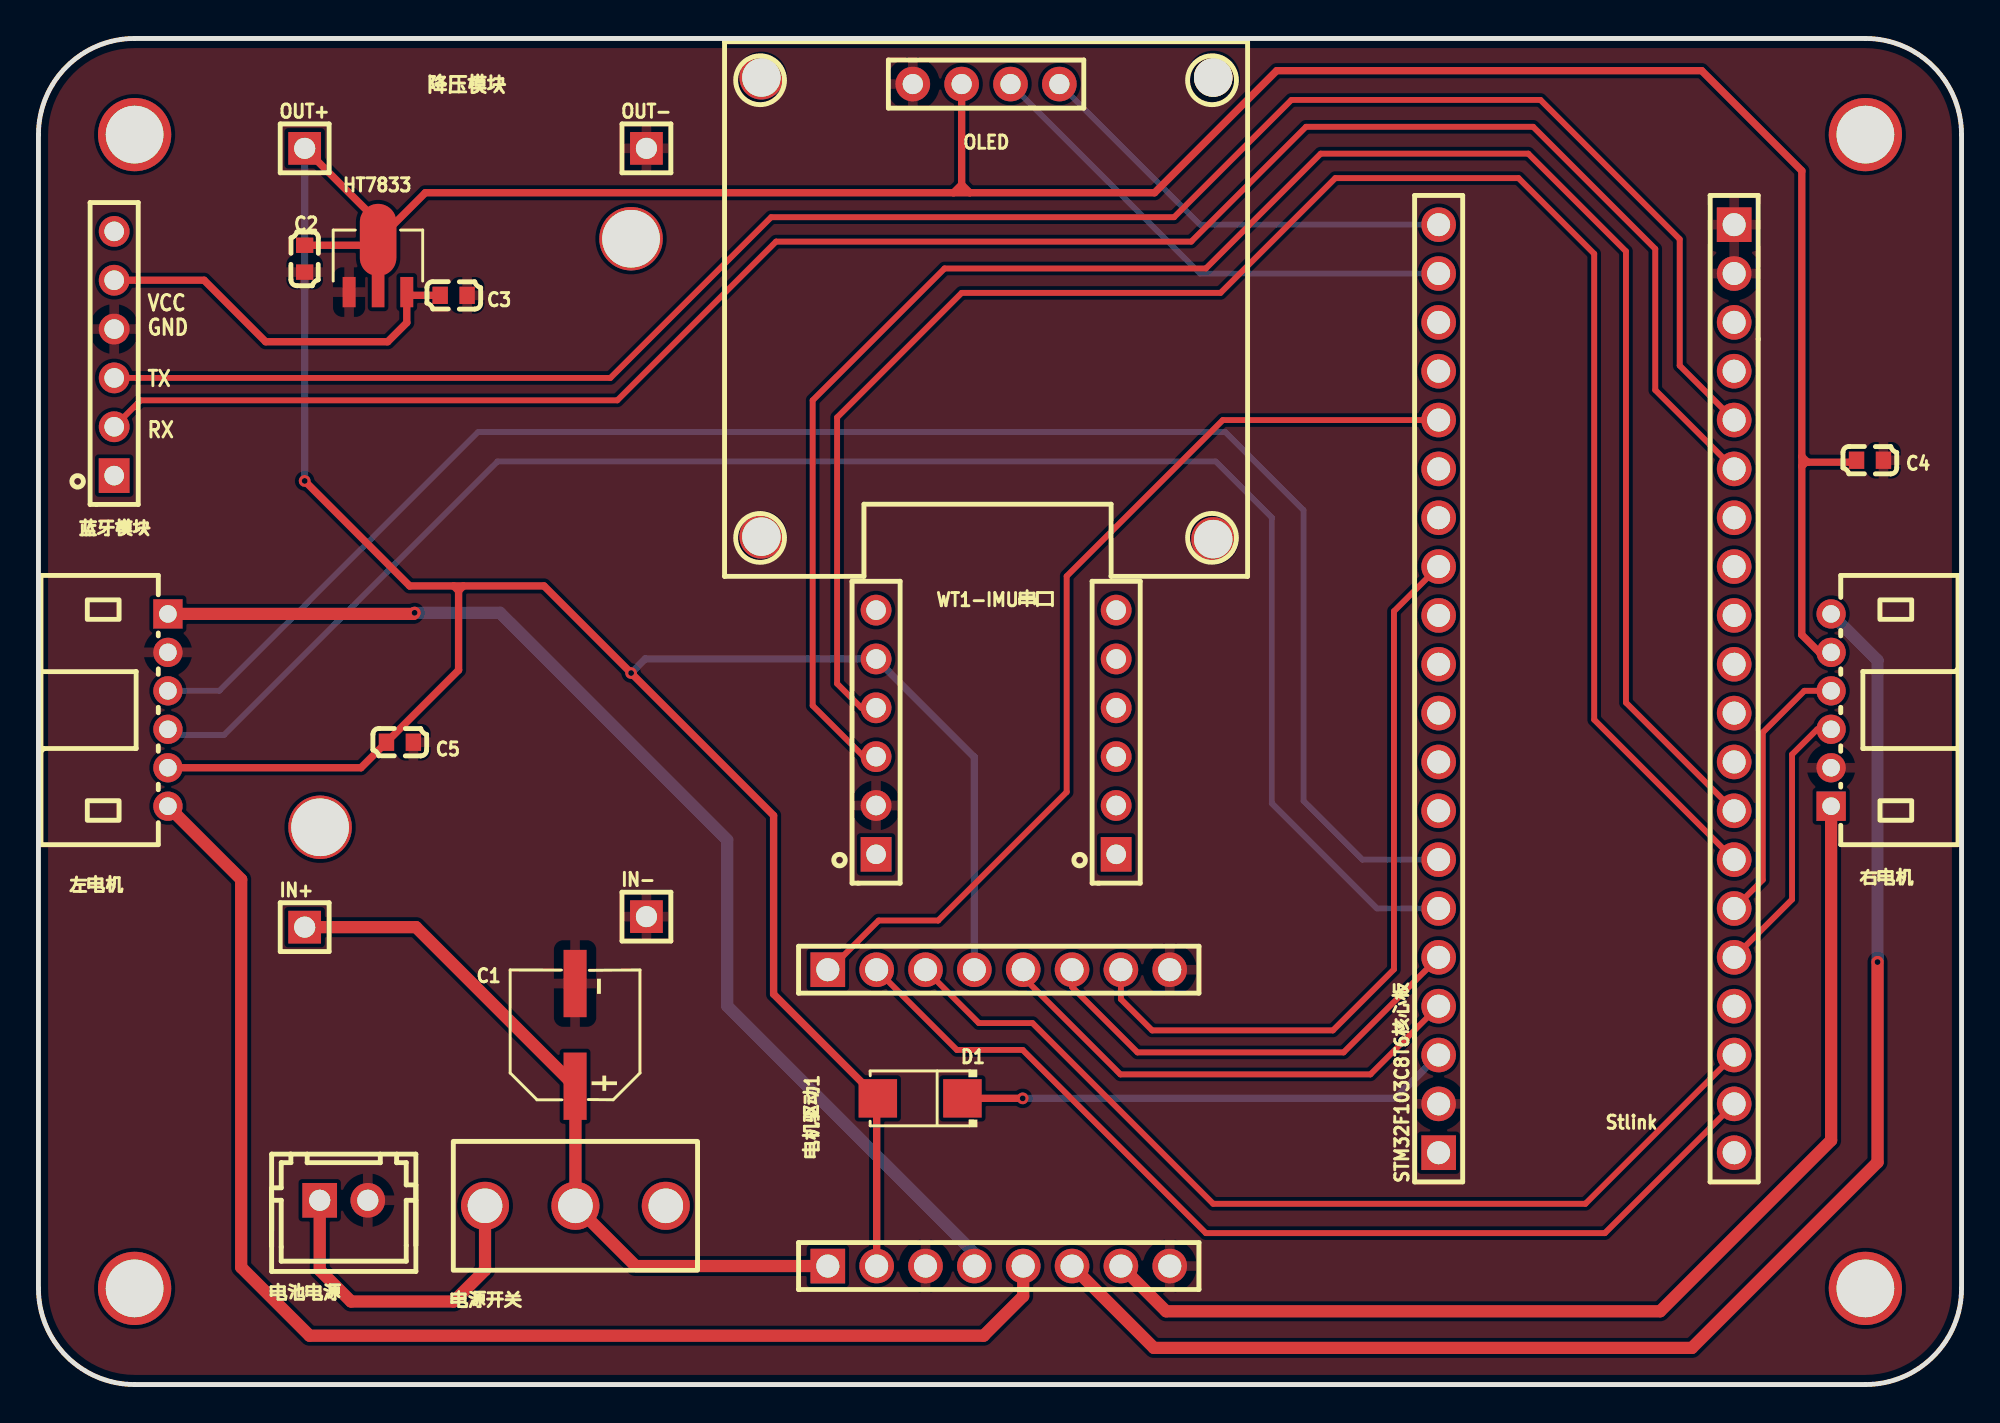
[diagram p7: board, top side]
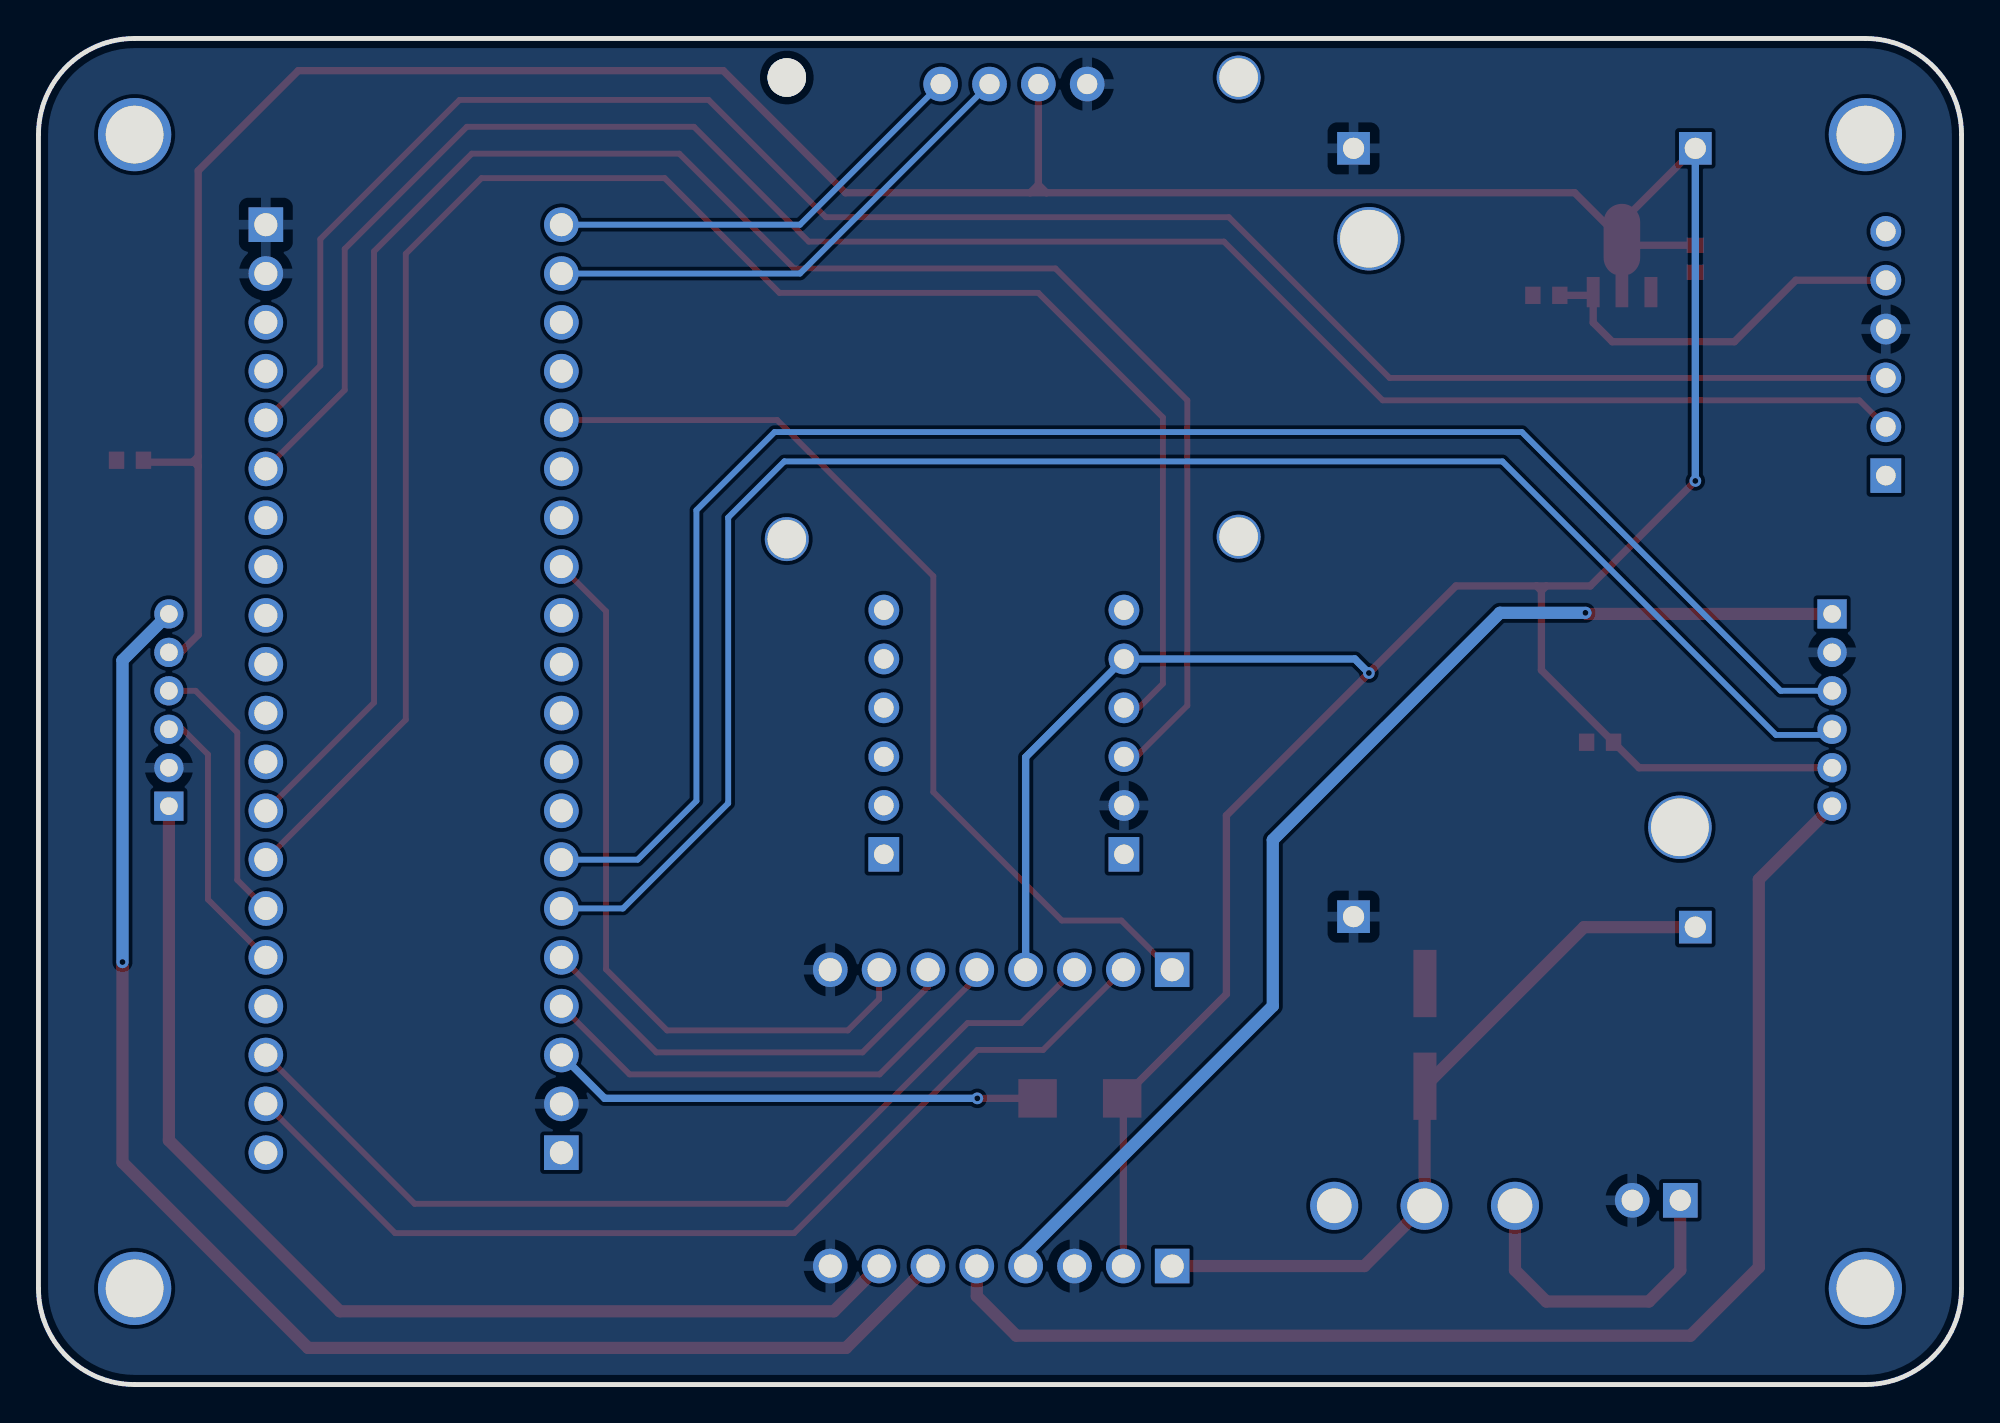
[diagram p8: board, bottom side, seen from below]

Outline 100 x 70 mm; copper layers: Top Layer, Bottom Layer. Coordinates in mm from the lower left corner of the outline.
Outline path: 0,65 0,5 arc(1.46,1.46) 5,0 95,0 arc(98.54,1.46) 100,5 100,65 arc(98.54,68.54) 95,70 5,70 arc(1.46,68.54) 0,65
Stack: Top Layer 0.035mm / Dielectric1 1.51mm FR4 er 4.5 / Bottom Layer 0.035mm

## Design rules (mm)
template: JLCPCB Capability(Two Layers Board)
spacing copperThickness1oz (default): track to track 0.102, other pairs 0.152 to 0.3
spacing copperThickness2oz: track to track 0.203, other pairs 0.152 to 0.3
track width copperThickness1oz (default): min 0.127, default 0.254, max 2.54
track width copperThickness2oz: min 0.203, default 0.254, max 2.54
differential pair differentialPair (default): width min 0.127, default 0.254, max 2.54; gap min 0.152, default 0.152
via viaSize (default): diameter min 0.5, default 0.61, max 10; hole min 0.3, default 0.305, max 6.3

## Placement (name value [footprint] x y rotation side)
C1  470uF  [CAP-SMD_BD6.3-L6.6-W6.6-LS7.6-RD]  27.9 18.18 90 top
C2  47uF  [C0603]  13.84 58.55 90 top
C3  47uF  [C0603]  21.59 56.64 180 top
C4  100nF  [C0603]  95.24 48.07 0 top
C5  100nF  [C0603]  18.8 33.4 0 top
D1  M7  [SMA_L4.3-W2.6-LS5.2-RD]  45.85 14.88 180 top
HT7833  HT7833  [SOT-89_L4.5-W2.5-P1.50-LS4.2-BR]  17.65 58.17 270 top
IN+  2.54-1*1P针  [HDR-TH_1P-P2.54-V-M]  13.84 23.79 0 top
IN-  2.54-1*1P针  [HDR-TH_1P-P2.54-V-M]  31.61 24.33 0 top
NOREF  -  [Pad_e1712]  95 5 0 top
NOREF#2  -  [Pad_e47]  61.09 43.96 0 top
NOREF#3  -  [Pad_e48]  37.59 44.09 0 top
NOREF#4  -  [Pad_e103]  30.81 59.59 0 top
NOREF#5  -  [Pad_e71]  14.64 28.98 0 top
NOREF#6  -  [Pad_e1710]  95 65 0 top
NOREF#7  -  [Pad_e1738]  5 5 0 top
NOREF#8  -  [Pad_e40]  37.59 67.97 0 top
NOREF#9  -  [Pad_e45]  61.09 67.97 0 top
NOREF#10  -  [Pad_e1713]  5 65 0 top
OLED  OLED  [OLED-TH_L27.8-W27.2-P2.54_C9900033791]  49.28 67.63 0 top
OUT+  2.54-1*1P针  [hdr-th_1p-p2.54-v-m]  13.84 64.28 0 top
OUT-  2.54-1*1P针  [hdr-th_1p-p2.54-v-m]  31.61 64.28 0 top
Stlink  Stlink  [HDR-TH_20P-P2.54-V-F]  88.18 36.19 270 top
STM32F103C8T6核心板  STM32F103C8T6核心板  [HDR-TH_20P-P2.54-V-F]  72.81 36.19 90 top
U1  2.54-1*6P母  [HDR-TH_6P-P2.54-V-F]  56.04 33.92 90 top
U3  2.54-1*8P母环保  [HDR-TH_8P-P2.54-V-F-1]  49.94 21.57 0 top
WT1-IMU串口  WT1-IMU串口  [HDR-TH_6P-P2.54-V-F]  43.56 33.92 90 top
右电机  HDGC2001WR-6P  [CONN-TH_6P-P2.00_HDGC_HDGC2001WR-6P]  93.22 35.07 90 top
左电机  HDGC2001WR-6P  [CONN-TH_6P-P2.00_HDGC_HDGC2001WR-6P]  6.73 35.07 270 top
电机驱动1  2.54-1*8P母环保  [HDR-TH_8P-P2.54-V-F-1]  49.94 6.16 0 top
电池电源  ZX-XH2.54-2PZZ  [CONN-TH_2P-P2.50_HX25003-2A]  15.88 9.58 0 top
电源开关  SS-12D10L5  [SW-TH_SS-12D10L5]  27.92 9.29 0 top
蓝牙模块  2.54-1*6P母  [HDR-TH_6P-P2.54-V-F]  3.94 53.62 90 top

## Footprints (pads in the part's own frame, mm; a bottom-side part is the same pattern mirrored in y, then rotated)
C0603
  rect 0.8x0.9 smd: 1(-0.7,0) 2(0.7,0)
CAP-SMD_BD6.3-L6.6-W6.6-LS7.6-RD
  rect 3.5x1.2 smd: 1(-2.67,0) 2(2.67,0)
CONN-TH_2P-P2.50_HX25003-2A
  rect 1.8x1.8 hole 1.1: 1(-1.25,0)
  round 1.8 hole 1.1: 2(1.25,0)
CONN-TH_6P-P2.00_HDGC_HDGC2001WR-6P
  rect 1.524x1.524 hole 0.914: 1(-5,0)
  round 1.524 hole 0.914: 2(-3,0) 3(-1,0) 4(1,0) 5(3,0) 6(5,0)
hdr-th_1p-p2.54-v-m
  rect 1.7x1.7 hole 1.1: 1(0,0)
HDR-TH_1P-P2.54-V-M
  rect 1.7x1.7 hole 1.1: 1(0,0)
HDR-TH_6P-P2.54-V-F
  rect 1.8x1.6 hole 1.02: 1(-6.35,0)
  round 1.6 hole 1.02: 2(-3.81,0) 3(-1.27,0) 4(1.27,0) 5(3.81,0) 6(6.35,0)
HDR-TH_8P-P2.54-V-F-1
  rect 1.8x1.8 hole 1.2: 1(-8.89,0)
  round 1.8 hole 1.2: 2(-6.35,0) 3(-3.81,0) 4(-1.27,0) 5(1.27,0) 6(3.81,0) 7(6.35,0) 8(8.89,0)
HDR-TH_20P-P2.54-V-F
  rect 1.8x1.8 hole 1.2: 1(-24.13,0)
  round 1.8 hole 1.2: 2(-21.59,0) 3(-19.05,0) 4(-16.51,0) 5(-13.97,0) 6(-11.43,0) 7(-8.89,0) 8(-6.35,0) 9(-3.81,0) 10(-1.27,0) 11(1.27,0) 12(3.81,0) 13(6.35,0) 14(8.89,0) 15(11.43,0) 16(13.97,0) 17(16.51,0) 18(19.05,0) 19(21.59,0) 20(24.13,0)
OLED-TH_L27.8-W27.2-P2.54_C9900033791
  round 1.8 hole 1.05: 1(-3.81,0) 2(-1.27,0) 3(1.27,0) 4(3.81,0)
Pad_e40
  round 2.286 hole 2: 5(0,0)
Pad_e45
  round 2 hole 2.286: 5(0,0)
Pad_e47
  round 2.286 hole 2: 5(0,0)
Pad_e48
  round 2.286 hole 2: 5(0,0)
Pad_e71
  round 3.302 hole 3: 5(0,0)
Pad_e103
  round 3.302 hole 3: 5(0,0)
Pad_e1710
  round 3.81 hole 3: 0(0,0)
Pad_e1712
  round 3.81 hole 3: 0(0,0)
Pad_e1713
  round 3.81 hole 3: 0(0,0)
Pad_e1738
  round 3.81 hole 3: 0(0,0)
SMA_L4.3-W2.6-LS5.2-RD
  rect 2x2 smd: 1(-2.2,0) 2(2.2,0)
SOT-89_L4.5-W2.5-P1.50-LS4.2-BR
  rect 1.575x0.672 smd: 1(1.356,-1.5) 3(1.356,1.5)
  custom 5.377x1.9 smd: 2(-1.356,0.009)
SW-TH_SS-12D10L5
  round 2.5 hole 1.8: 1(-4.7,0) 2(0,0) 3(4.7,0)

## Nets
As in the schematic.

Pads without a net: NOREF 0; NOREF#2 5; NOREF#3 5; NOREF#4 5; NOREF#5 5; NOREF#6 0; NOREF#7 0; NOREF#8 5; NOREF#9 5; NOREF#10 0; U1 1 2 3 4 5 6; 电源开关 3; 蓝牙模块 1 6

## Via types
v1: diameter 0.61, hole 0.305, Top Layer to Bottom Layer, 5 vias

## Routing (per net, layer and track width the routed paths; a pad name or vN(x,y) marks a point on that pad's centre or on a via; arc(x,y) is an arc through that point)
3.3V: length 20.3
  Top Layer w0.381: 蓝牙模块.5 8.61,57.43 11.81,54.23 18.16,54.23 19.15,55.22 19.15,56.81 19.32,56.64 C3.2
5V: length 253.9
  Top Layer w0.381: 47.58,61.98 48.43,61.98 ; 47.58,61.98 48.01,62.4 ; 47.58,61.98 20.12,61.98 17.66,59.52 ; 48.43,61.98 58.04,61.98 64.39,68.33 86.49,68.33 91.69,63.12 91.69,48.26 ; 48.43,61.98 48.01,62.4 ; 21.85,41.27 21.85,37.15 C5.1 16.77,32.07 左电机.5 ; 21.85,41.27 21.85,41.28 22.1,41.53 ; 21.85,41.27 21.59,41.53 ; 22.1,41.53 21.59,41.53 ; 22.1,41.53 26.29,41.53 v1(30.82,37) 38.23,29.59 38.23,20.3 D1.2 43.59,14.82 电机驱动1.2 ; 21.59,41.53 19.3,41.53 v1(13.84,46.99) ; 右电机.5 92.61,38.07 91.69,38.99 91.69,47.75 ; 17.66,59.52 17.66,60.47 OUT+.1 ; 17.66,59.52 17.39,59.25 C2.2 ; 91.69,48.26 91.69,47.75 ; 91.69,48.26 91.99,47.96 ; 91.69,47.75 91.91,47.96 91.99,47.96 ; 91.99,47.96 94.44,47.96 C4.1 ; 48.01,62.4 OLED.2
  Bottom Layer w0.381: OUT+.1 v1(13.84,46.99) ; v1(30.82,37) 31.55,37.73 WT1-IMU串口.5 48.67,32.62 U3.4
5VIN: length 25.7
  Top Layer w0.381: D1.1 v1(51.18,14.88)
  Bottom Layer w0.381: STM32F103C8T6核心板.3 70.55,14.88 v1(51.18,14.88)
12V: length 38.1
  Top Layer w0.635: 电机驱动1.1 31.05,6.16 电源开关.2 27.92,15.5 C1.1 19.63,23.79 IN+.1
6-12V: length 16.9
  Top Layer w0.635: 电池电源.1 14.62,5.95 16.26,4.32 21.59,4.32 23.22,5.95 电源开关.1
A_M1: length 61.5
  Top Layer w0.635: v1(19.56,40.13) 19.5,40.07 左电机.1
  Bottom Layer w0.635: v1(19.56,40.13) 24,40.13 35.81,28.32 35.81,19.68 48.67,6.83 电机驱动1.4
A_M2: length 70.1
  Top Layer w0.635: 电机驱动1.5 51.21,4.6 49.15,2.54 14.1,2.54 10.54,6.1 10.54,26.26 左电机.6
AIN1: length 50.3
  Top Layer w0.305: Stlink.18 80.44,9.4 61.09,9.4 51.69,18.8 48.9,18.8 U3.3
AIN2: length 53
  Top Layer w0.305: U3.2 47.76,17.4 51.18,17.4 60.71,7.87 81.45,7.87 Stlink.19
B_M1: length 59
  Top Layer w0.635: 电机驱动1.7 58.64,3.81 84.33,3.81 93.22,12.7 右电机.1
B_M2: length 77.2
  Top Layer w0.635: v1(95.63,21.97) 95.63,11.56 85.98,1.91 58,1.91 电机驱动1.6
  Bottom Layer w0.635: v1(95.63,21.97) 95.63,37.66 右电机.6
BIN1: length 25.6
  Top Layer w0.305: U3.5 51.21,21.18 56.26,16.13 69.26,16.13 STM32F103C8T6核心板.4
BIN2: length 23.4
  Top Layer w0.305: STM32F103C8T6核心板.5 67.86,17.27 57.15,17.27 53.75,20.68 U3.6
BLE_RX: length 102.4
  Top Layer w0.305: 蓝牙模块.2 5.31,51.18 30.1,51.18 38.35,59.44 59.94,59.44 65.91,65.4 77.72,65.4 84.07,59.05 84.07,51.72 Stlink.6
BLE_TX: length 101
  Top Layer w0.305: Stlink.5 85.34,52.99 85.34,59.56 78.11,66.8 65.15,66.8 59.05,60.71 38.1,60.71 29.74,52.35 蓝牙模块.3
PA0: length 14.4
  Top Layer w0.305: 右电机.3 92.49,34.07 91.19,32.77 91.19,25.23 Stlink.16
PA1: length 14.2
  Top Layer w0.305: 88.18,24.76 89.66,26.24 89.66,33.91 91.83,36.07 右电机.4
PA2: length 97.1
  Top Layer w0.305: WT1-IMU串口.4 42.79,35.19 41.53,36.45 41.53,50.29 48.01,56.77 61.47,56.77 67.44,62.74 76.96,62.74 80.9,58.8 80.9,34.57 Stlink.14
PA3: length 101.4
  Top Layer w0.305: 88.18,29.84 82.55,35.46 82.55,58.93 77.47,64.01 66.67,64.01 60.71,58.04 47.12,58.04 40.26,51.18 40.26,35.31 42.91,32.65 WT1-IMU串口.3
PA8: length 50.2
  Top Layer w0.305: U3.1 41.13,21.57 43.69,24.13 46.78,24.13 53.47,30.81 53.47,42.04 61.59,50.16 STM32F103C8T6核心板.16
PA11: length 39.6
  Top Layer w0.305: U3.7 56.29,20.04 57.91,18.41 67.31,18.41 70.48,21.59 70.48,40.21 STM32F103C8T6核心板.13
PB6: length 89.7
  Bottom Layer w0.305: 左电机.3 9.41,36.07 22.86,49.53 61.72,49.53 65.79,45.47 65.79,30.35 68.84,27.3 STM32F103C8T6核心板.7
PB7: length 90.4
  Bottom Layer w0.305: 左电机.4 7.02,33.78 9.65,33.78 23.88,48.01 61.21,48.01 64.14,45.08 64.14,30.23 69.61,24.76 72.81,24.76
PB12: length 22.8
  Bottom Layer w0.305: OLED.4 60.4,60.32 STM32F103C8T6核心板.20
PB13: length 26.3
  Bottom Layer w0.305: 72.81,57.78 60.4,57.78 OLED.3

## Copper pours and planes (outline as drawn; the poured copper is in the pictures)
GND on Top Layer: -10.03,80.14 115.06,80.14 115.06,-10.8 -10.03,-10.8
GND on Bottom Layer: -6.73,74.42 107.44,74.42 107.44,-3.56 -6.73,-3.56

## Text on the board
Top Silkscreen Layer: VCC | GND | TX | RX | 降压模块
